# EAGLE design proto2 (EAGLE 9.5.0)

## Sheet 1 of 7: Front End
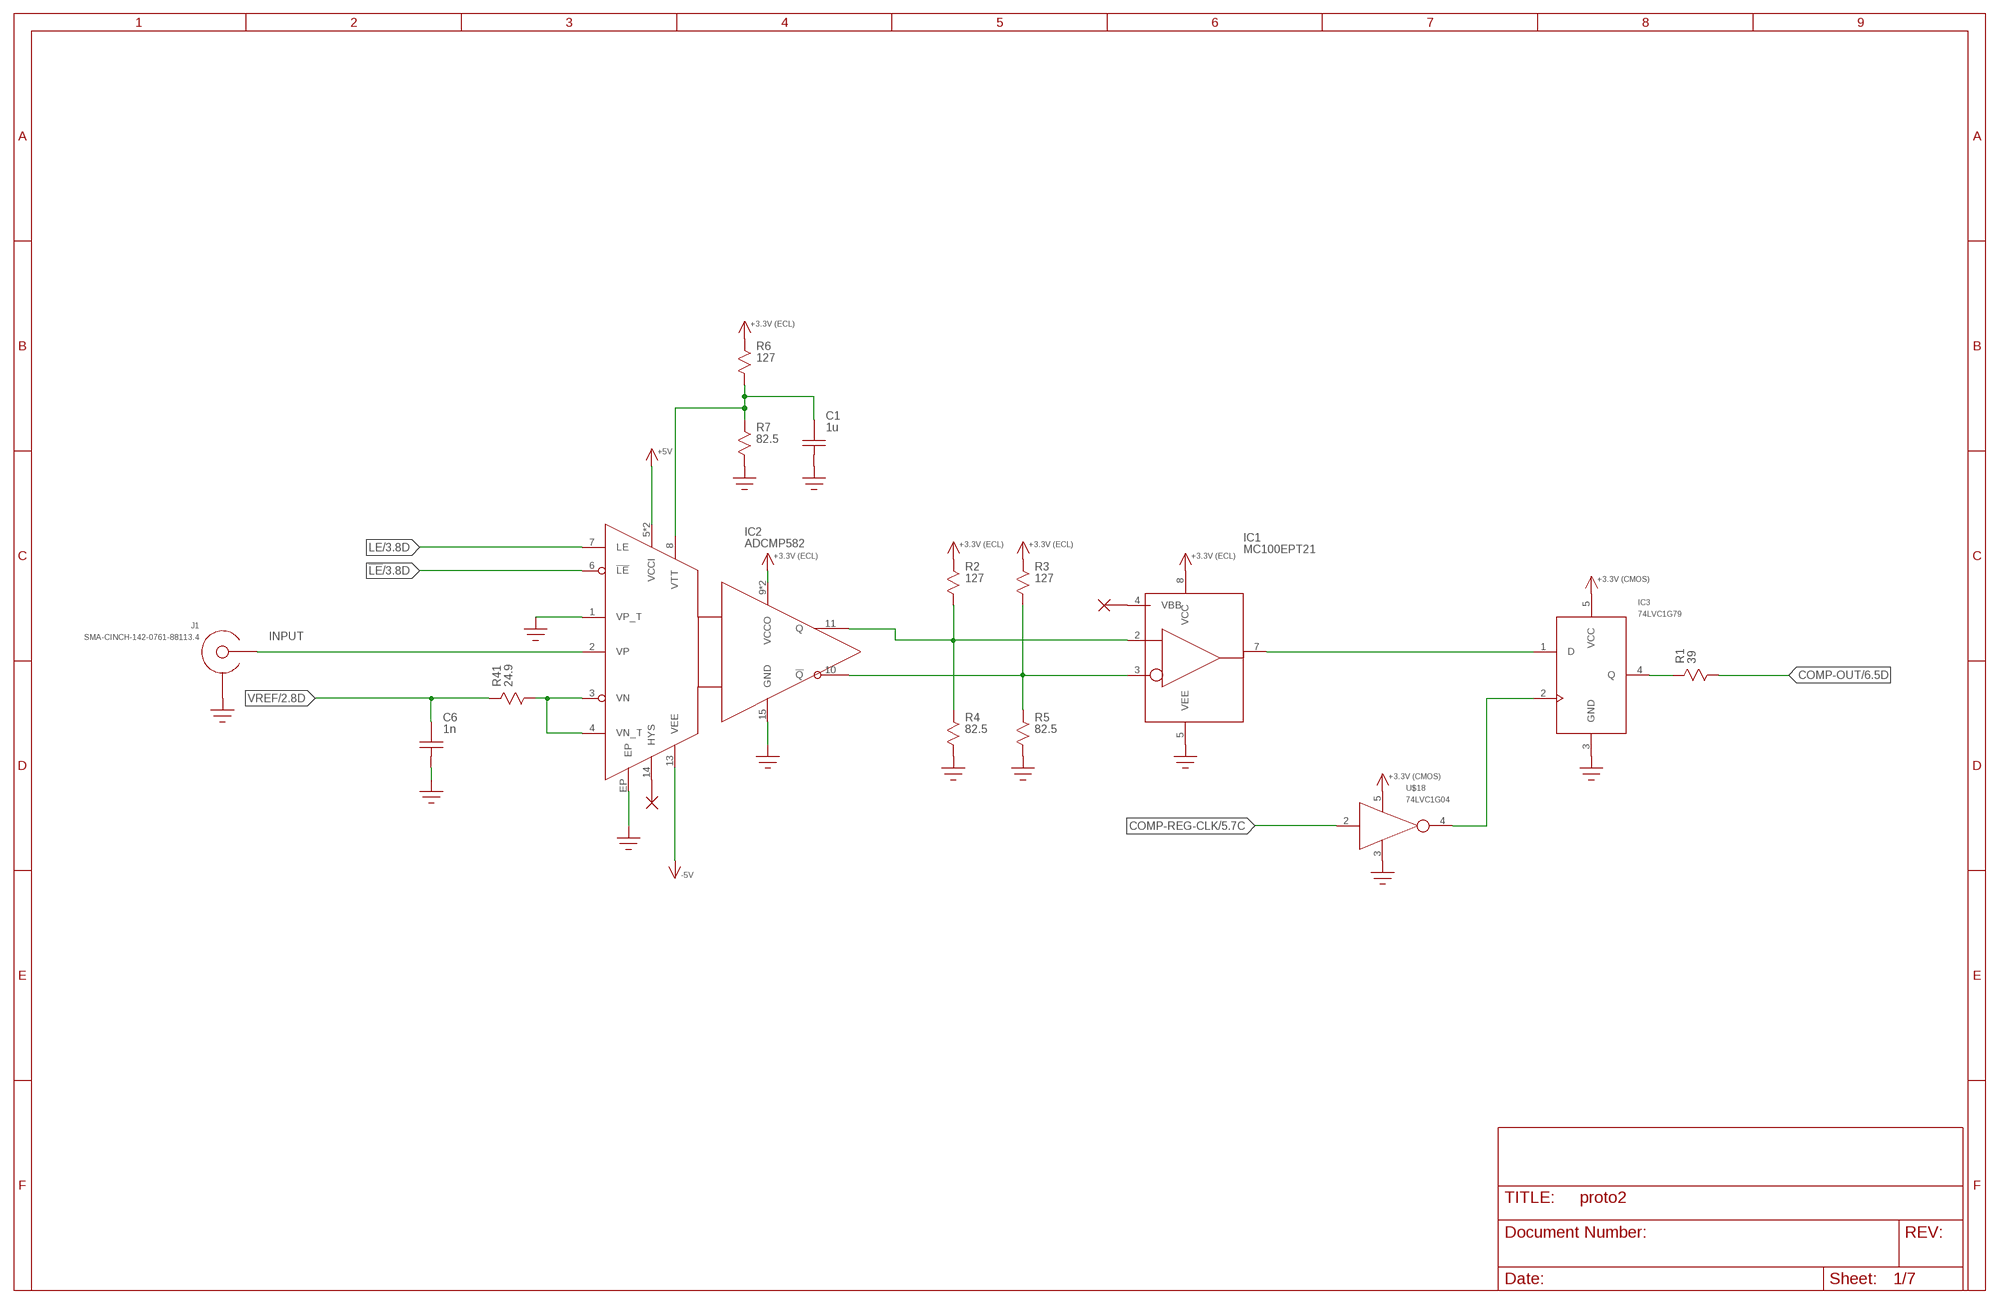
[diagram p0: schematic, sheet 1]

### Parts
C1  1u  C  [C0402]
C6  1n  C  [C0402]
IC1  MC100EPT21  [SOIC8]
IC2  ADCMP582  [TQFN16-EP]
IC3  74LVC1G79  [SOT23-5]
J1  SMA-CINCH-142-0761-88113.4  [SMA-CINCH-142-0761-881-13.4]
R1  39  R0603  [R0603]
R2  127  R0603  [R0603]
R3  127  R0603  [R0603]
R4  82.5  R0603  [R0603]
R5  82.5  R0603  [R0603]
R6  127  R0603  [R0603]
R7  82.5  R0603  [R0603]
R41  24.9  R0402  [0402]
U$4  NO_CONNECT  (no package)
U$9  NO_CONNECT  (no package)
U$18  74LVC1G04  [SOT23-5]

### Nets
!LE! [13.4-6]: IC2.6(!LE!) ; also sheet 3
+5V: IC2.5(VCCI) IC2.16(VCCI) ; also sheet 2,7
-5V: IC2.13(VEE) ; also sheet 2,7
COMP-OUT: R1.P$2 ; also sheet 6
COMP-REG-CLK: U$18.2(IN) ; also sheet 5
GND: C1.1 C6.1 IC1.5(VEE) IC2.1(VP_T) IC2.15(GND) IC2.EP IC3.3(GND) J1.GND@1(SHIELD) J1.GND@2(SHIELD) J1.GND@3(SHIELD) J1.HOLE@1(SHIELD) J1.HOLE@2(SHIELD) J1.HOLE@3(SHIELD) J1.HOLE@4(SHIELD) J1.VIA@1(SHIELD) J1.VIA@2(SHIELD) J1.VIA@3(SHIELD) J1.VIA@4(SHIELD) J1.VIA@5(SHIELD) J1.VIA@6(SHIELD) R4.P$2 R5.P$2 R7.P$2 U$18.3(GND) ; also sheet 2,3,4,5,6,7
INPUT [13.4-6]: IC2.2(VP) J1.CENTER
LE [13.4-6]: IC2.7(LE) ; also sheet 3
N$1: IC2.14(HYS) U$4.P$1
N$2: C1.2 IC2.8(VTT) R6.P$2 R7.P$1
N$3: IC1.4(VBB) U$9.P$1
N$4 [13.4-6]: IC1.3(!D!) IC2.10(!Q!) R3.P$2 R5.P$1
N$5 [13.4-6]: IC1.2(D) IC2.11(Q) R2.P$2 R4.P$1
N$7: IC1.7(Q) IC3.1(D)
N$8: IC3.4(Q) R1.P$1
N$9: IC3.2(CLK) U$18.4(OUT)
N$42: IC2.3(VN) IC2.4(VN_T) R41.2
VCC1: IC1.8(VCC) IC2.9(VCCO) IC2.12(VCCO) R2.P$1 R3.P$1 R6.P$1 ; supply symbol labelled +3.3V (ECL) ; also sheet 2,3,4,5,7
VCC2: IC3.5(VCC) U$18.5(VCC) ; supply symbol labelled +3.3V (CMOS) ; also sheet 5,6,7
VREF: C6.2 R41.1 ; also sheet 2

## Sheet 2 of 7: Reference Voltage Generator
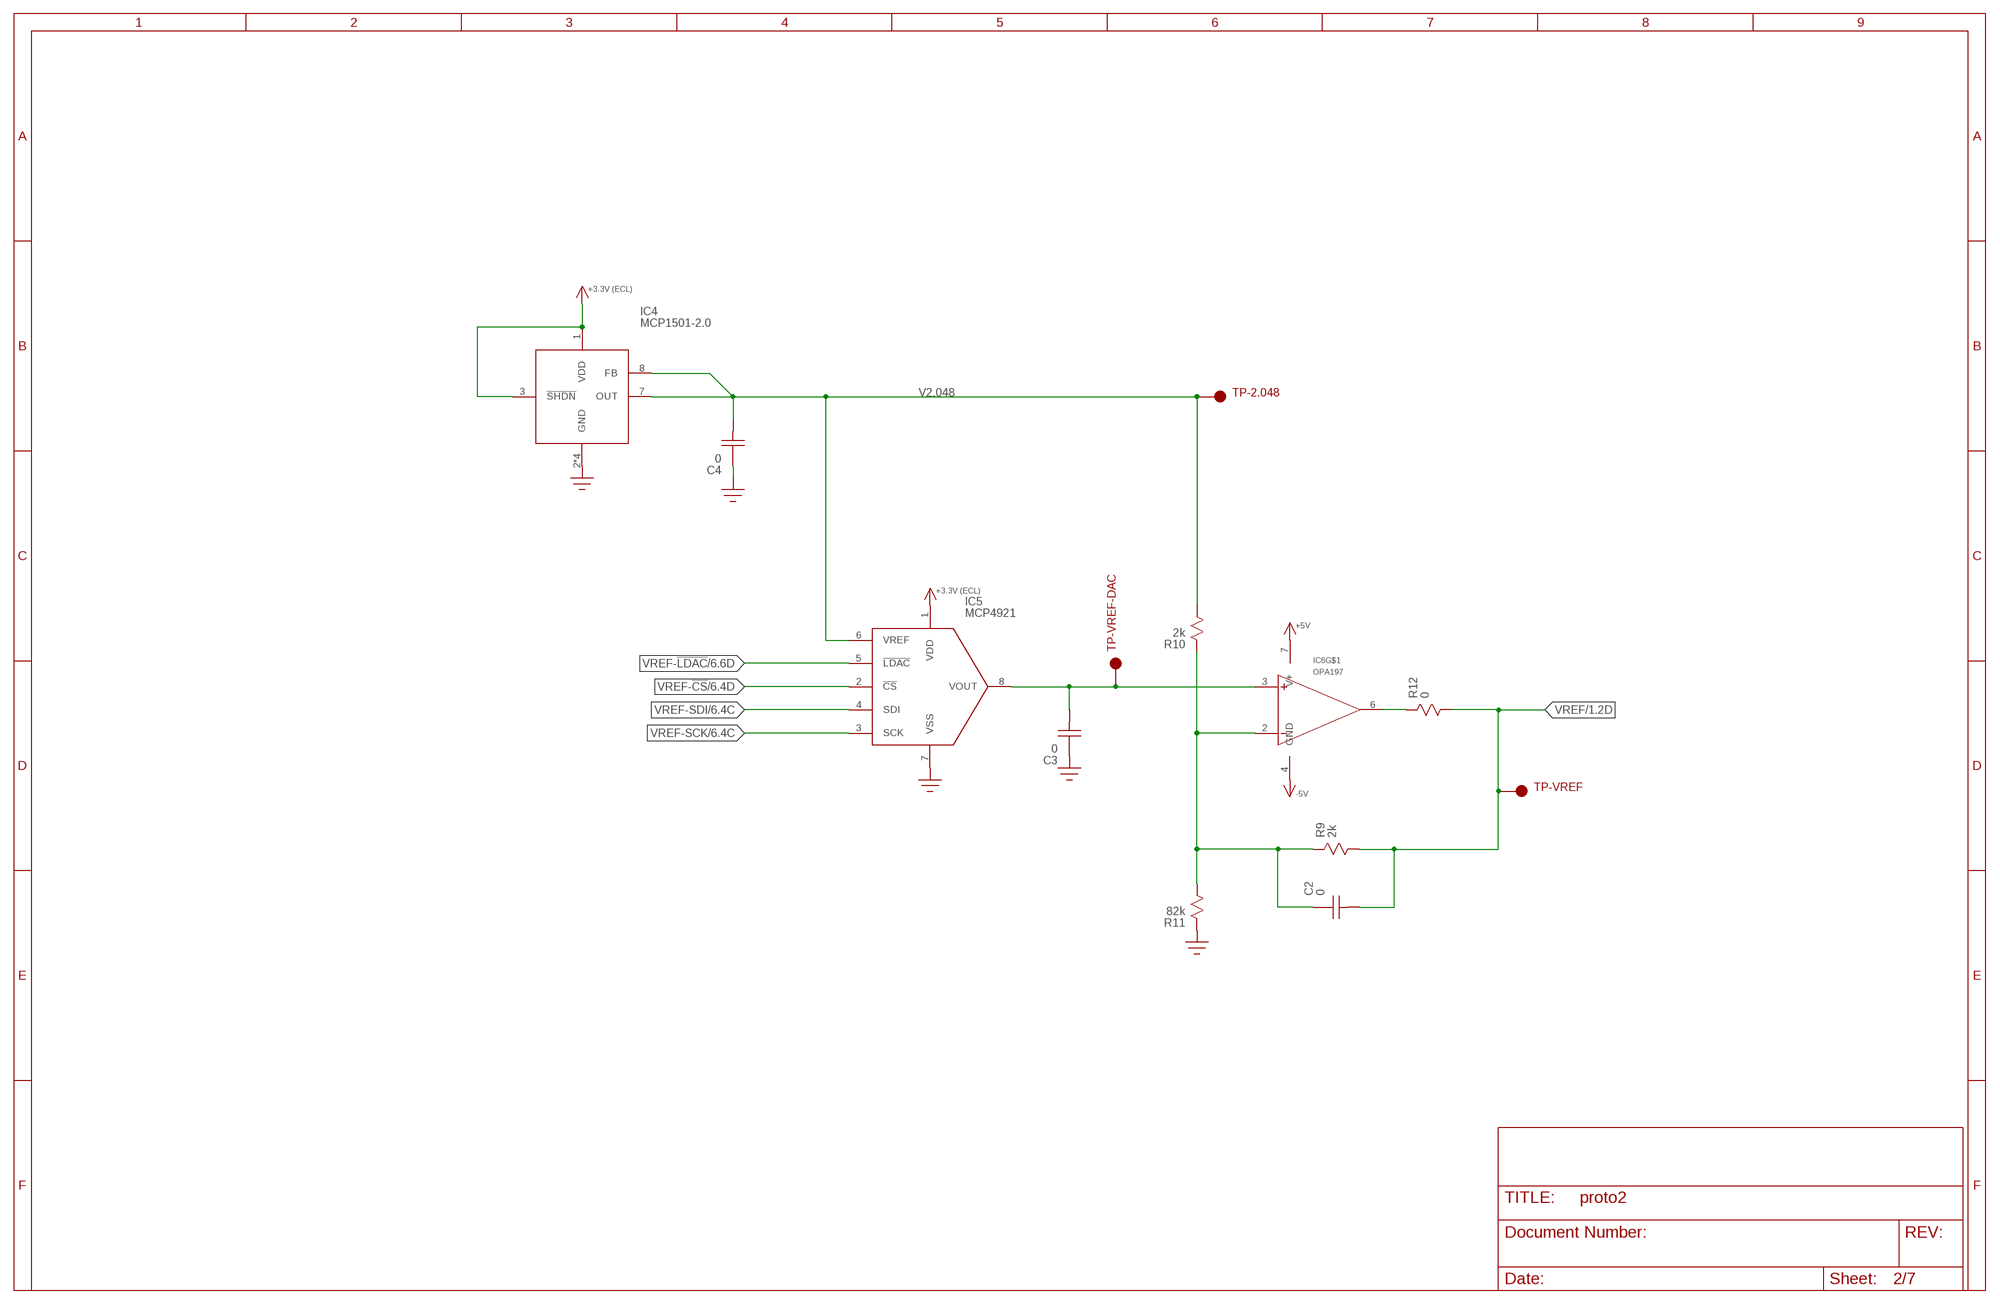
[diagram p1: schematic, sheet 2]

### Parts
C2  0  C0603  [C0603]
C3  0  C0603  [C0603]
C4  0  C0603  [C0603]
IC4  MCP1501-2.0  MCP1501SOIC8  [SOIC8]
IC5  MCP4921  MCP49X1  [SOIC8]
IC6  OPA197  OPA197SOIC8  [SOIC8]
R9  2k  R0603  [R0603]
R10  2k  R0603  [R0603]
R11  82k  R0603  [R0603]
R12  0  R0603  [R0603]
TP-2.048  ICSP_PAD  [ICSP_PAD]
TP-VREF  ICSP_PAD  [ICSP_PAD]
TP-VREF-DAC  ICSP_PAD  [ICSP_PAD]

### Nets
+5V: IC6.7(V+) ; also sheet 1,7
-5V: IC6.4(GND) ; also sheet 1,7
GND: C3.P$2 C4.P$2 IC4.2(GND) IC4.4(GND) IC4.5(GND) IC4.6(GND) IC5.7(VSS) R11.P$1 ; also sheet 1,3,4,5,6,7
N$6: C2.P$2 IC6.2(-) R9.P$1 R10.P$1 R11.P$2
N$11: IC6.6(OUT) R12.P$1
N$12: C3.P$1 IC5.8(VOUT) IC6.3(+) TP-VREF-DAC.P$1
V2.048: C4.P$1 IC4.7(OUT) IC4.8(FB) IC5.6(VREF) R10.P$2 TP-2.048.P$1
VCC1: IC4.1(VDD) IC4.3(!SHDN!) IC5.1(VDD) ; supply symbol labelled +3.3V (ECL) ; also sheet 1,3,4,5,7
VREF: C2.P$1 R9.P$2 R12.P$2 TP-VREF.P$1 ; also sheet 1
VREF-!CS!: IC5.2(!CS!) ; also sheet 6
VREF-!LDAC!: IC5.5(!LDAC!) ; also sheet 6
VREF-SCK: IC5.3(SCK) ; also sheet 6
VREF-SDI: IC5.4(SDI) ; also sheet 6

## Sheet 3 of 7: Delay Line
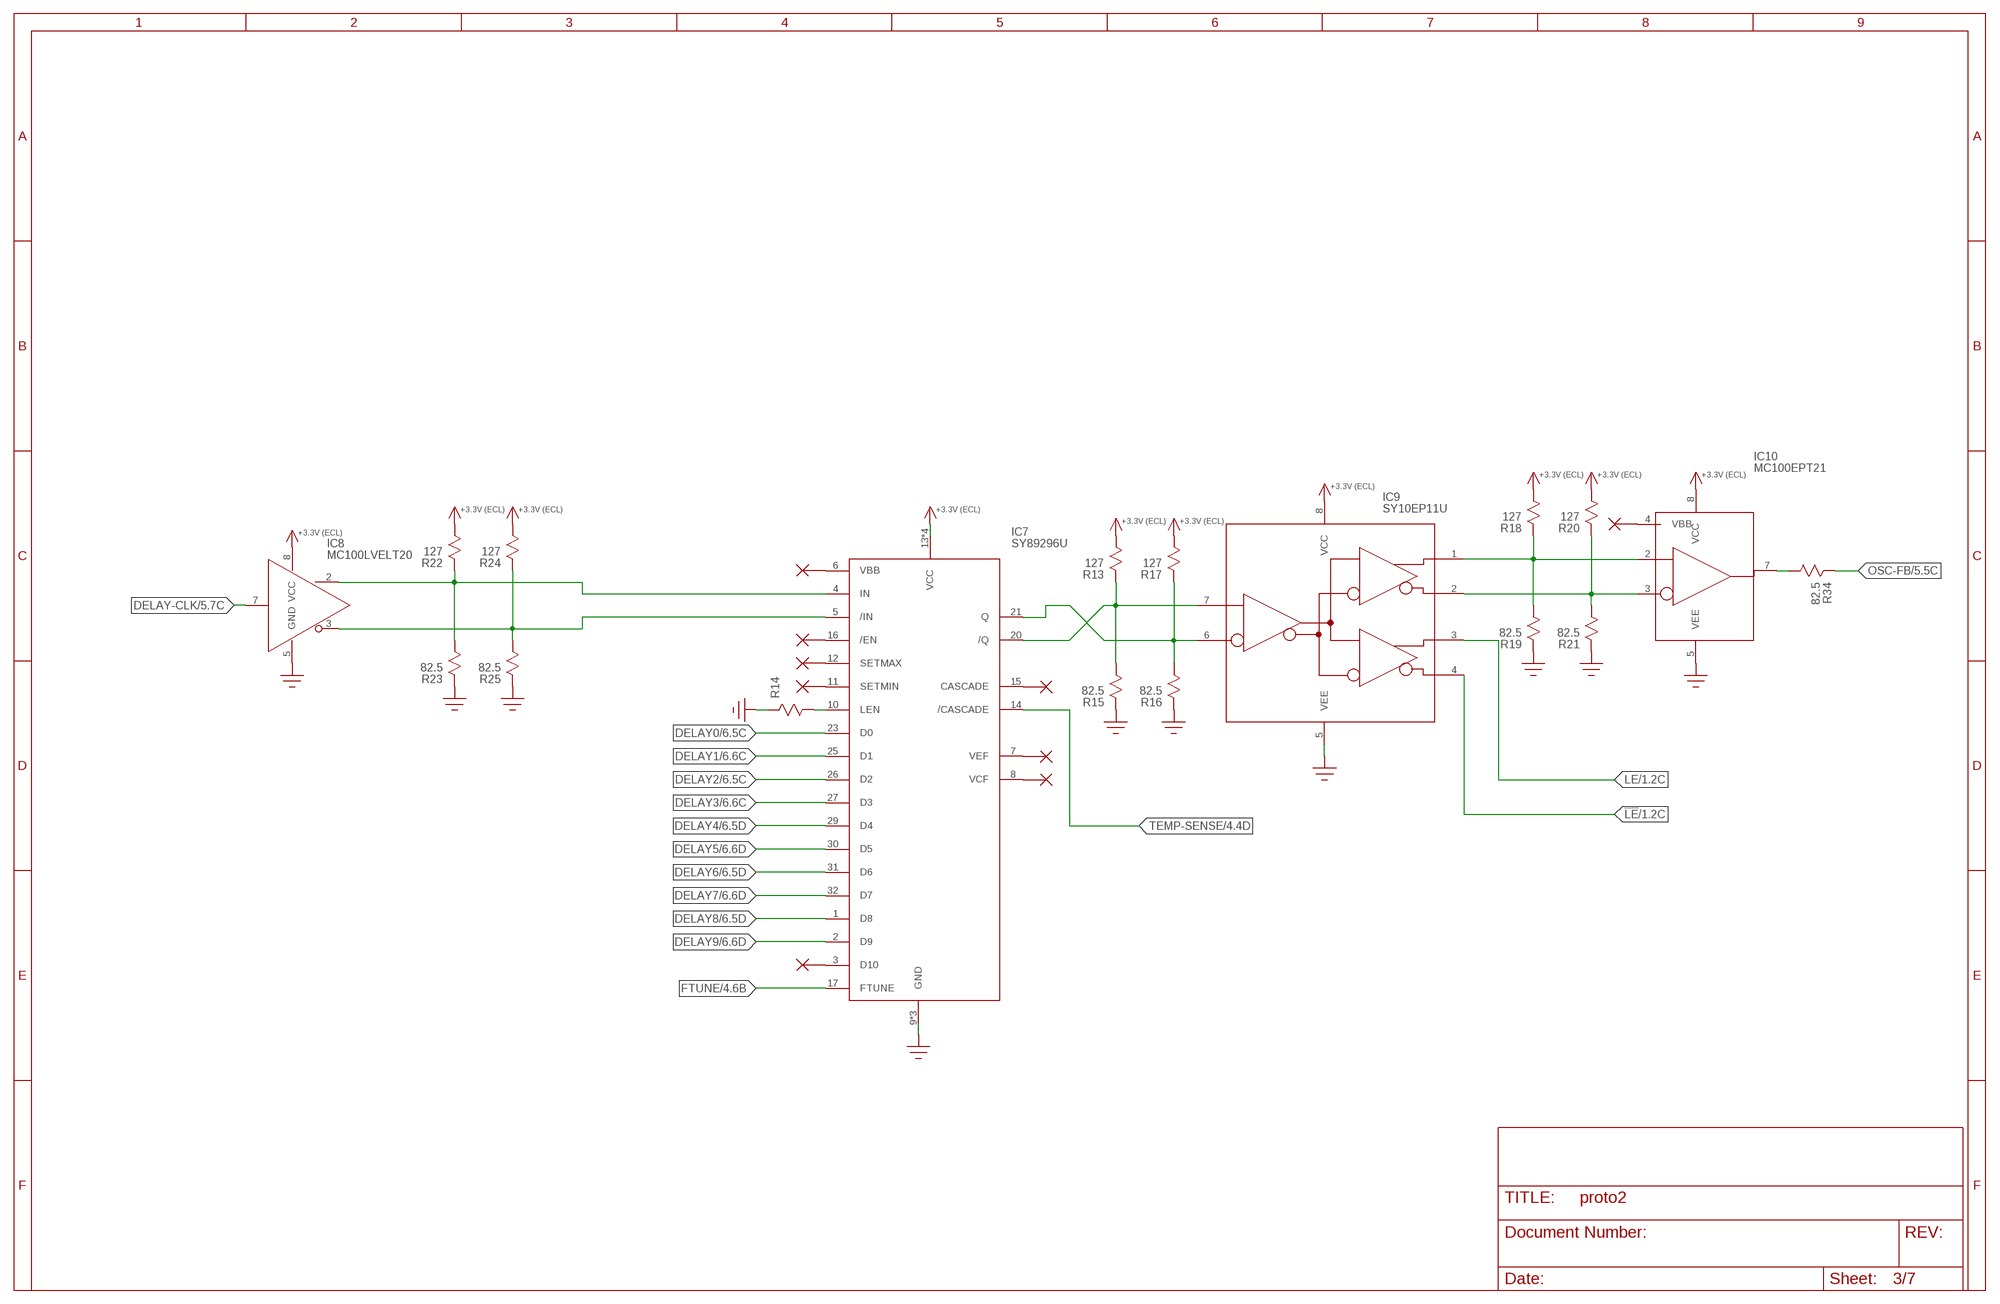
[diagram p2: schematic, sheet 3]

### Parts
IC7  SY89296U  [TQFP32_7X7]
IC8  MC100LVELT20  [SOIC8]
IC9  SY10EP11U  [SOIC8]
IC10  MC100EPT21  [SOIC8]
R13  127  R0603  [R0603]
R14  R0603  [R0603]
R15  82.5  R0603  [R0603]
R16  82.5  R0603  [R0603]
R17  127  R0603  [R0603]
R18  127  R0603  [R0603]
R19  82.5  R0603  [R0603]
R20  127  R0603  [R0603]
R21  82.5  R0603  [R0603]
R22  127  R0603  [R0603]
R23  82.5  R0603  [R0603]
R24  127  R0603  [R0603]
R25  82.5  R0603  [R0603]
R34  82.5  R0603  [R0603]
U$25  NO_CONNECT  (no package)
U$35  NO_CONNECT  (no package)
U$36  NO_CONNECT  (no package)
U$37  NO_CONNECT  (no package)
U$39  NO_CONNECT  (no package)
U$40  NO_CONNECT  (no package)
U$41  NO_CONNECT  (no package)
U$42  NO_CONNECT  (no package)
U$51  NO_CONNECT  (no package)

### Nets
!LE! [13.4-6]: IC9.4(!Q1!) ; also sheet 1
DELAY0: IC7.23(D0) ; also sheet 6
DELAY1: IC7.25(D1) ; also sheet 6
DELAY2: IC7.26(D2) ; also sheet 6
DELAY3: IC7.27(D3) ; also sheet 6
DELAY4: IC7.29(D4) ; also sheet 6
DELAY5: IC7.30(D5) ; also sheet 6
DELAY6: IC7.31(D6) ; also sheet 6
DELAY7: IC7.32(D7) ; also sheet 6
DELAY8: IC7.1(D8) ; also sheet 6
DELAY9: IC7.2(D9) ; also sheet 6
DELAY-!IN!: IC7.5(/IN) IC8.3(!Q!) R24.P$1 R25.P$2
DELAY-CLK: IC8.7(D) ; also sheet 5
DELAY-IN: IC7.4(IN) IC8.2(Q) R22.P$1 R23.P$2
FTUNE: IC7.17(FTUNE) ; also sheet 4
GND: IC7.9(GND) IC7.24(GND) IC7.28(GND) IC8.5(GND) IC9.5(VEE) IC10.5(VEE) R14.P$1 R15.P$1 R16.P$1 R19.P$1 R21.P$1 R23.P$1 R25.P$1 ; also sheet 1,2,4,5,6,7
LE [13.4-6]: IC9.3(Q1) ; also sheet 1
N$14: IC7.3(D10) U$25.P$1
N$15: IC7.7(VEF) U$35.P$1
N$16: IC7.8(VCF) U$36.P$1
N$17: IC7.6(VBB) U$37.P$1
N$18: IC7.10(LEN) R14.P$2
N$19: IC7.12(SETMAX) U$39.P$1
N$20: IC7.11(SETMIN) U$40.P$1
N$21: IC7.16(/EN) U$41.P$1
N$22: IC7.15(CASCADE) U$42.P$1
N$24: IC10.7(Q) R34.P$2
N$25 [13.4-6]: IC7.20(/Q) IC9.7(D) R13.P$1 R15.P$2
N$26 [13.4-6]: IC9.1(Q0) IC10.2(D) R18.P$1 R19.P$2
N$27 [13.4-6]: IC7.21(Q) IC9.6(!D!) R16.P$2 R17.P$1
N$28: IC10.4(VBB) U$51.P$1
N$40 [13.4-6]: IC9.2(!Q0!) IC10.3(!D!) R20.P$1 R21.P$2
OSC-FB: R34.P$1 ; also sheet 5
TEMP-SENSE: IC7.14(/CASCADE) ; also sheet 4
VCC1: IC7.13(VCC) IC7.18(VCC) IC7.19(VCC) IC7.22(VCC) IC8.8(VCC) IC9.8(VCC) IC10.8(VCC) R13.P$2 R17.P$2 R18.P$2 R20.P$2 R22.P$2 R24.P$2 ; supply symbol labelled +3.3V (ECL) ; also sheet 1,2,4,5,7

## Sheet 4 of 7: Delay Tune
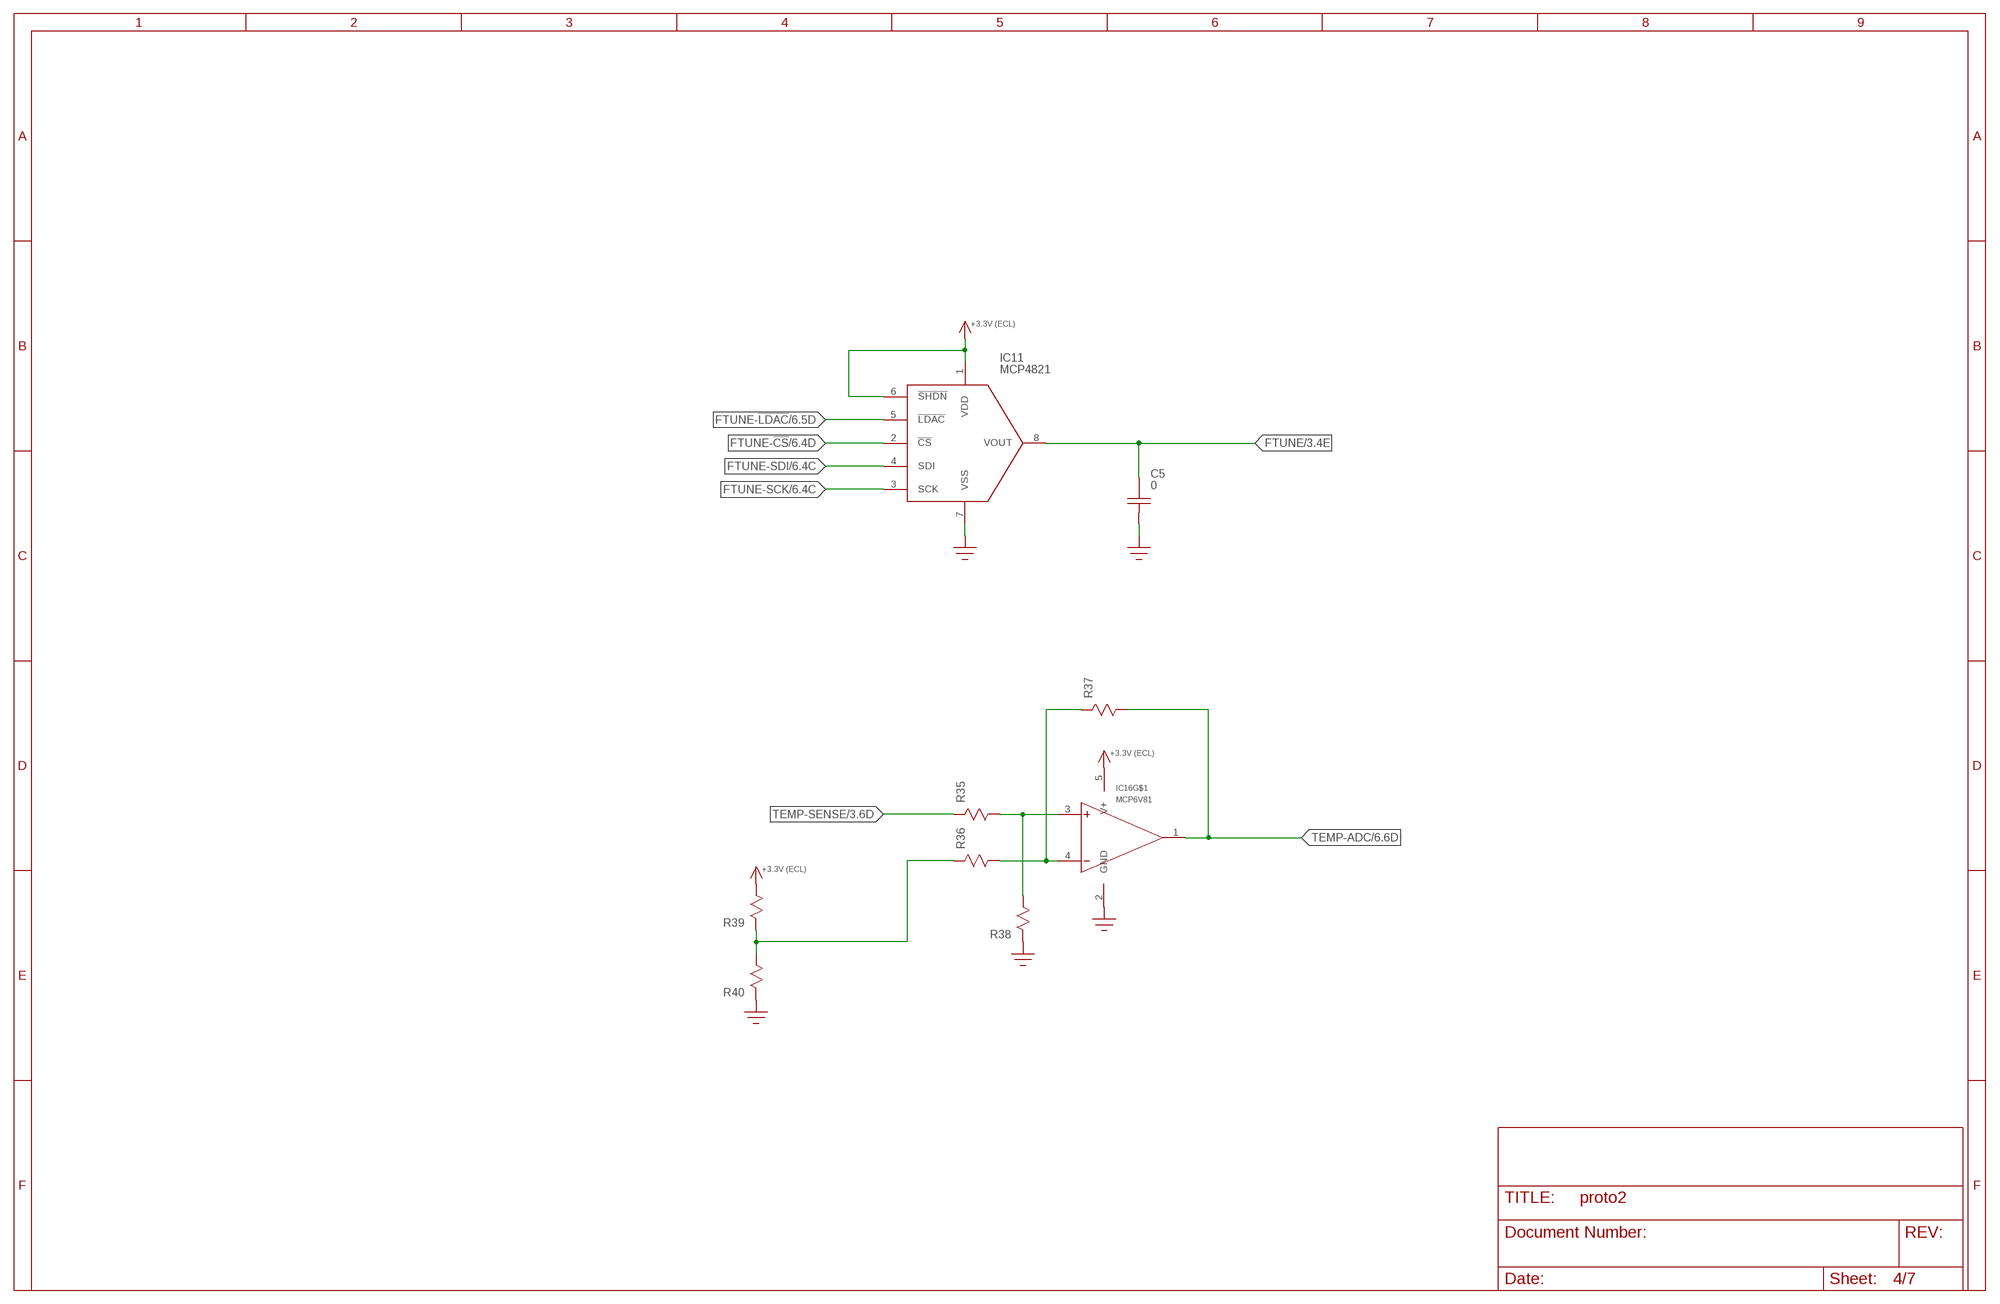
[diagram p3: schematic, sheet 4]

### Parts
C5  0  C0603  [C0603]
IC11  MCP4821  MCP48X1  [SOIC8]
IC16  MCP6V81  [SOT23-5]
R35  R0603  [R0603]
R36  R0603  [R0603]
R37  R0603  [R0603]
R38  R0603  [R0603]
R39  R0603  [R0603]
R40  R0603  [R0603]

### Nets
FTUNE: C5.P$2 IC11.8(VOUT) ; also sheet 3
FTUNE-!CS!: IC11.2(!CS!) ; also sheet 6
FTUNE-!LDAC!: IC11.5(!LDAC!) ; also sheet 6
FTUNE-SCK: IC11.3(SCK) ; also sheet 6
FTUNE-SDI: IC11.4(SDI) ; also sheet 6
GND: C5.P$1 IC11.7(VSS) IC16.2(GND) R38.P$1 R40.P$1 ; also sheet 1,2,3,5,6,7
N$35: IC16.3(+) R35.P$2 R38.P$2
N$41: IC16.4(-) R36.P$2 R37.P$1
N$44: R36.P$1 R39.P$1 R40.P$2
TEMP-ADC: IC16.1(OUT) R37.P$2 ; also sheet 6
TEMP-SENSE: R35.P$1 ; also sheet 3
VCC1: IC11.1(VDD) IC11.6(!SHDN!) IC16.5(V+) R39.P$2 ; supply symbol labelled +3.3V (ECL) ; also sheet 1,2,3,5,7

## Sheet 5 of 7: Clock Distribution
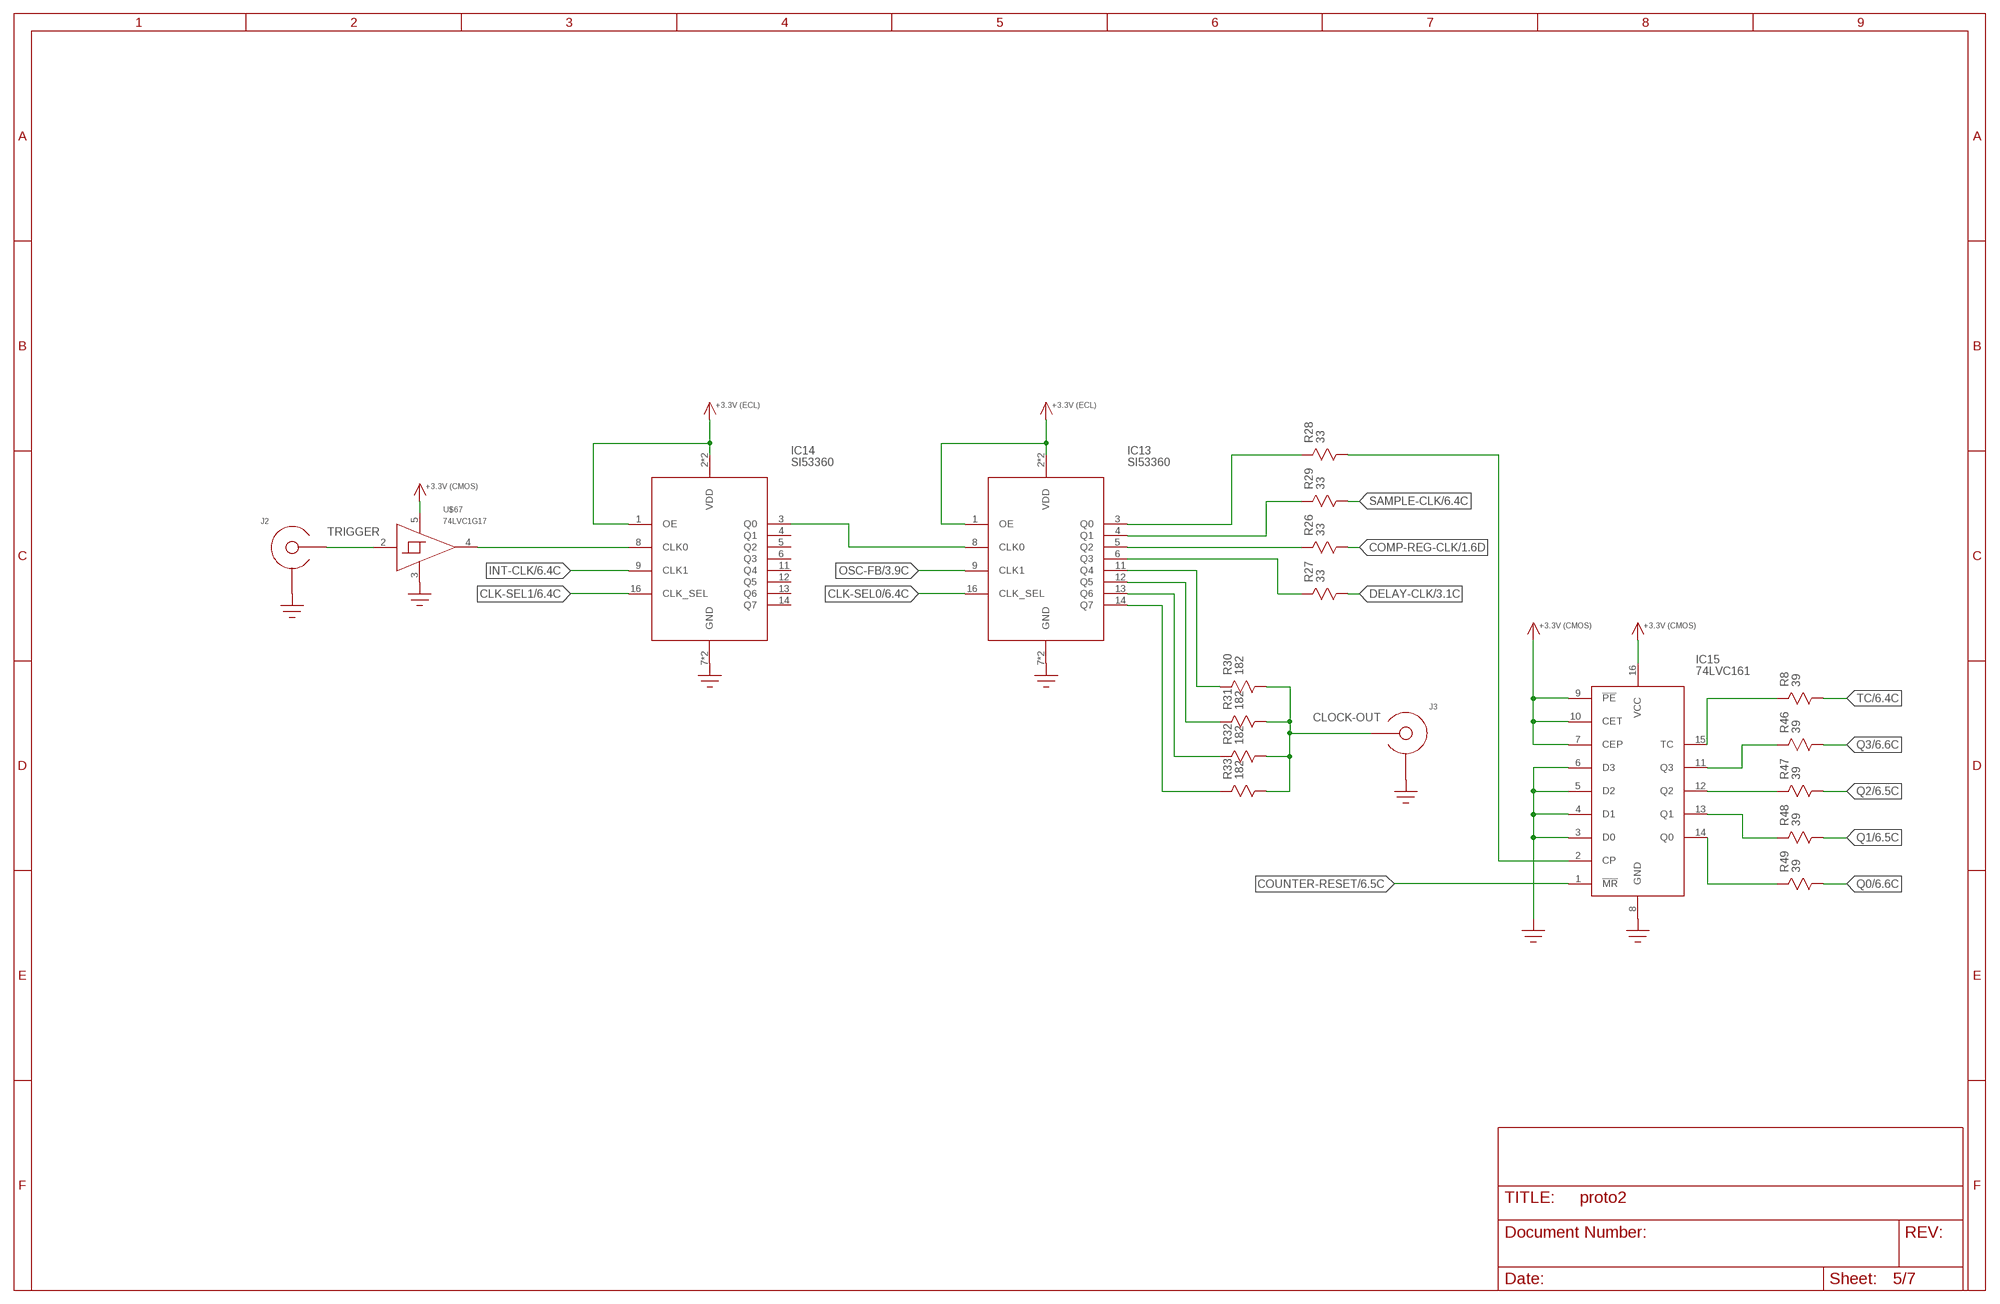
[diagram p4: schematic, sheet 5]

### Parts
IC13  SI53360  SI53360TSSOP16  [TSSOP16]
IC14  SI53360  SI53360TSSOP16  [TSSOP16]
IC15  74LVC161  74XX161  [SOIC-16]
J2  SMA-EDGE-LAUNCH4L-4020-TAPER-FIXED  [SMA_EDGE_LAUNCH_4L_4020_TAPER_FIXED]
J3  SMA-EDGE-LAUNCH4L-4020-TAPER-FIXED  [SMA_EDGE_LAUNCH_4L_4020_TAPER_FIXED]
R8  39  R0402  [0402]
R26  33  R0603  [R0603]
R27  33  R0603  [R0603]
R28  33  R0603  [R0603]
R29  33  R0603  [R0603]
R30  182  R0603  [R0603]
R31  182  R0603  [R0603]
R32  182  R0603  [R0603]
R33  182  R0603  [R0603]
R46  39  R0402  [0402]
R47  39  R0402  [0402]
R48  39  R0402  [0402]
R49  39  R0402  [0402]
U$67  74LVC1G17  [SOT23-5]

### Nets
CLK-SEL0: IC13.16(CLK_SEL) ; also sheet 6
CLK-SEL1: IC14.16(CLK_SEL) ; also sheet 6
CLOCK-OUT: J3.CENTER@1(CENTER) J3.P$3(CENTER) R30.P$2 R31.P$2 R32.P$2 R33.P$2
COMP-REG-CLK: R26.P$2 ; also sheet 1
COUNTER-RESET: IC15.1(!MR!) ; also sheet 6
DELAY-CLK: R27.P$2 ; also sheet 3
GND: IC13.7(GND) IC13.10(GND) IC14.7(GND) IC14.10(GND) IC15.3(D0) IC15.4(D1) IC15.5(D2) IC15.6(D3) IC15.8(GND) J2.BOTTOM_GND(SHIELD) J2.GND@1(SHIELD) J2.GND@2(SHIELD) J2.GND@3(SHIELD) J2.GND@4(SHIELD) J2.GND@5(SHIELD) J2.GND@6(SHIELD) J2.GND@7(SHIELD) J2.GND@8(SHIELD) J2.GND@14(SHIELD) J2.GND@15(SHIELD) J2.GND@16(SHIELD) J2.GND@17(SHIELD) J2.GND_PAD1(SHIELD) J2.GND_PAD2(SHIELD) J2.P$1(SHIELD) J2.P$2(SHIELD) J3.BOTTOM_GND(SHIELD) J3.GND@1(SHIELD) J3.GND@2(SHIELD) J3.GND@3(SHIELD) J3.GND@4(SHIELD) J3.GND@5(SHIELD) J3.GND@6(SHIELD) J3.GND@7(SHIELD) J3.GND@8(SHIELD) J3.GND@14(SHIELD) J3.GND@15(SHIELD) J3.GND@16(SHIELD) J3.GND@17(SHIELD) J3.GND_PAD1(SHIELD) J3.GND_PAD2(SHIELD) J3.P$1(SHIELD) J3.P$2(SHIELD) U$67.3(GND) ; also sheet 1,2,3,4,6,7
INT-CLK: IC14.9(CLK1) ; also sheet 6
N$13: IC15.12(Q2) R47.1
N$23: IC13.5(Q2) R26.P$1
N$29: IC13.6(Q3) R27.P$1
N$30: IC13.4(Q1) R29.P$1
N$31: IC14.8(CLK0) U$67.4(OUT)
N$32: IC13.8(CLK0) IC14.3(Q0)
N$33: IC13.3(Q0) R28.P$1
N$34: IC15.2(CP) R28.P$2
N$36: IC13.11(Q4) R30.P$1
N$37: IC13.12(Q5) R31.P$1
N$38: IC13.13(Q6) R32.P$1
N$39: IC13.14(Q7) R33.P$1
N$55: IC15.11(Q3) R46.1
N$56: IC15.15(TC) R8.1
N$57: IC15.13(Q1) R48.1
N$58: IC15.14(Q0) R49.1
OSC-FB: IC13.9(CLK1) ; also sheet 3
Q0: R49.2 ; also sheet 6
Q1: R48.2 ; also sheet 6
Q2: R47.2 ; also sheet 6
Q3: R46.2 ; also sheet 6
SAMPLE-CLK: R29.P$2 ; also sheet 6
TC: R8.2 ; also sheet 6
TRIGGER: J2.CENTER@1(CENTER) J2.P$3(CENTER) U$67.2(IN)
VCC1: IC13.1(OE) IC13.2(VDD) IC13.15(VDD) IC14.1(OE) IC14.2(VDD) IC14.15(VDD) ; supply symbol labelled +3.3V (ECL) ; also sheet 1,2,3,4,7
VCC2: IC15.7(CEP) IC15.9(!PE!) IC15.10(CET) IC15.16(VCC) U$67.5(VCC) ; supply symbol labelled +3.3V (CMOS) ; also sheet 1,6,7
Unconnected: IC14.4(Q1) IC14.5(Q2) IC14.6(Q3) IC14.11(Q4) IC14.12(Q5) IC14.13(Q6) IC14.14(Q7)

## Sheet 6 of 7: Microcontroller
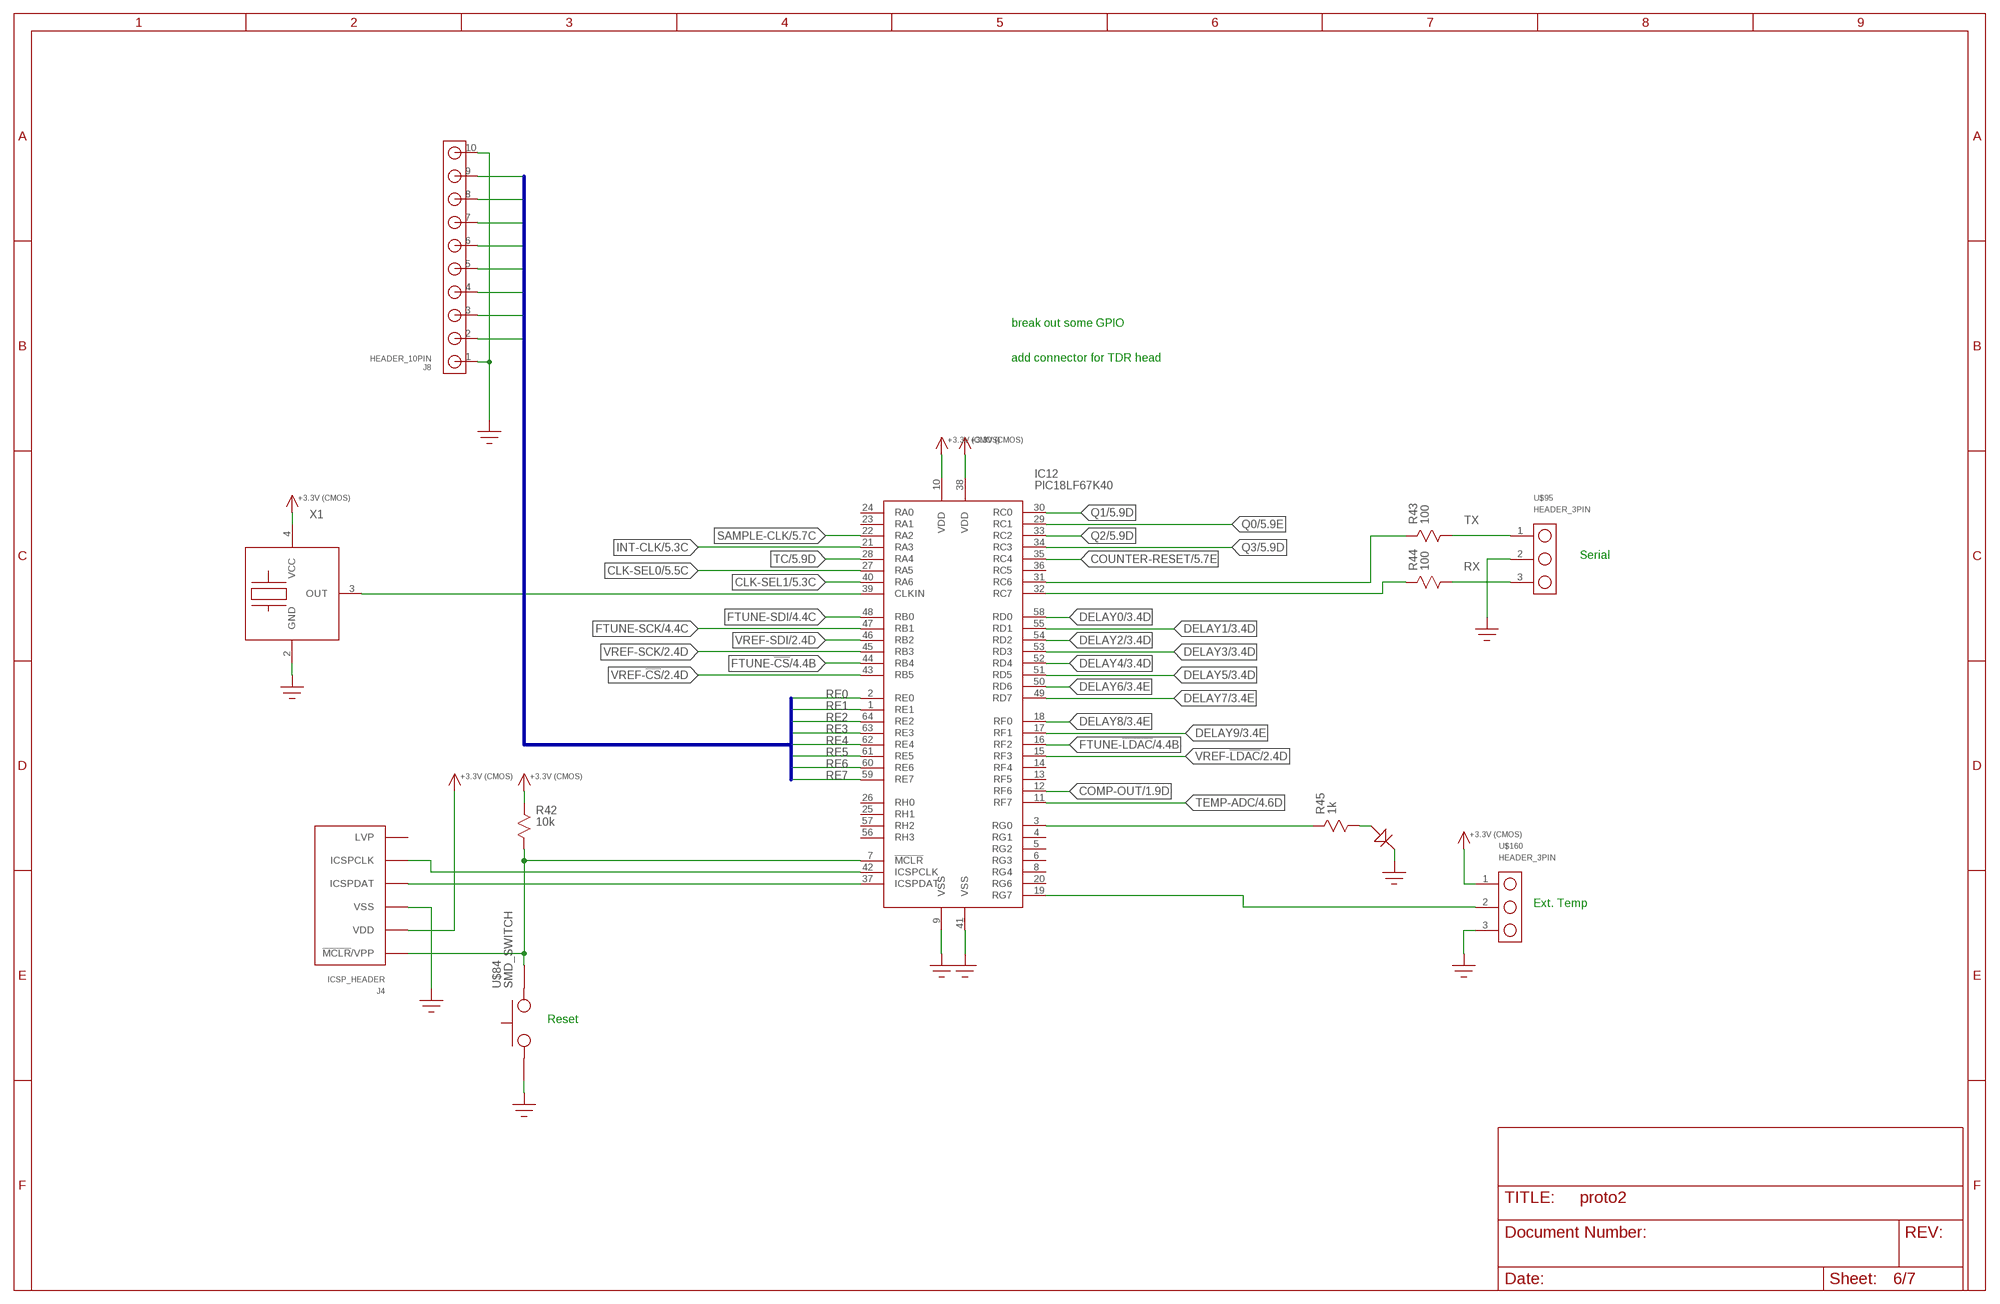
[diagram p5: schematic, sheet 6]

### Parts
IC12  PIC18LF67K40  [TQFP-100-10X10]
J4  ICSP_HEADER  [HEADER_6PIN]
J8  HEADER_10PIN  [HEADER_10PIN]
R42  10k  R0603  [R0603]
R43  100  R0603  [R0603]
R44  100  R0603  [R0603]
R45  1k  R0603  [R0603]
U$84  SMD_SWITCH  [SMD_SWITCH]
U$95  HEADER_3PIN  [HEADER_3PIN]
U$97  LED_0603  [LED_0603]
U$160  HEADER_3PIN  [HEADER_3PIN]
X1  XTAL_OSC  [XTAL_3.2X5]

### Nets
CLK-SEL0: IC12.27(RA5) ; also sheet 5
CLK-SEL1: IC12.40(RA6) ; also sheet 5
COMP-OUT: IC12.12(RF6) ; also sheet 1
COUNTER-RESET: IC12.35(RC4) ; also sheet 5
DELAY0: IC12.58(RD0) ; also sheet 3
DELAY1: IC12.55(RD1) ; also sheet 3
DELAY2: IC12.54(RD2) ; also sheet 3
DELAY3: IC12.53(RD3) ; also sheet 3
DELAY4: IC12.52(RD4) ; also sheet 3
DELAY5: IC12.51(RD5) ; also sheet 3
DELAY6: IC12.50(RD6) ; also sheet 3
DELAY7: IC12.49(RD7) ; also sheet 3
DELAY8: IC12.18(RF0) ; also sheet 3
DELAY9: IC12.17(RF1) ; also sheet 3
FTUNE-!CS!: IC12.44(RB4) ; also sheet 4
FTUNE-!LDAC!: IC12.16(RF2) ; also sheet 4
FTUNE-SCK: IC12.47(RB1) ; also sheet 4
FTUNE-SDI: IC12.48(RB0) ; also sheet 4
GND: IC12.9(VSS) IC12.41(VSS) J4.3(VSS) J8.1 J8.10 U$84.P$1 U$84.P$2 U$95.2 U$97.C U$160.3 X1.2(GND) ; also sheet 1,2,3,4,5,7
INT-CLK: IC12.21(RA3) ; also sheet 5
N$10: IC12.7(!MCLR!) J4.1(!MCLR!/VPP) R42.P$2 U$84.P$3 U$84.P$4
N$43: IC12.37(ICSPDAT) J4.4(ICSPDAT)
N$45: IC12.42(ICSPCLK) J4.5(ICSPCLK)
N$46: R45.P$2 U$97.A
N$47: IC12.39(CLKIN) X1.3(OUT)
N$48: IC12.32(RC7) R44.P$1
N$49: IC12.31(RC6) R43.P$1
N$50: IC12.3(RG0) R45.P$1
N$54: IC12.19(RG7) U$160.2
Q0: IC12.29(RC1) ; also sheet 5
Q1: IC12.30(RC0) ; also sheet 5
Q2: IC12.33(RC2) ; also sheet 5
Q3: IC12.34(RC3) ; also sheet 5
RE0: IC12.2(RE0) J8.9
RE1: IC12.1(RE1) J8.8
RE2: IC12.64(RE2) J8.7
RE3: IC12.63(RE3) J8.6
RE4: IC12.62(RE4) J8.5
RE5: IC12.61(RE5) J8.4
RE6: IC12.60(RE6) J8.3
RE7: IC12.59(RE7) J8.2
RX: R44.P$2 U$95.3
SAMPLE-CLK: IC12.22(RA2) ; also sheet 5
TC: IC12.28(RA4) ; also sheet 5
TEMP-ADC: IC12.11(RF7) ; also sheet 4
TX: R43.P$2 U$95.1
VCC2: IC12.10(VDD) IC12.38(VDD) J4.2(VDD) R42.P$1 U$160.1 X1.4(VCC) ; supply symbol labelled +3.3V (CMOS) ; also sheet 1,5,7
VREF-!CS!: IC12.43(RB5) ; also sheet 2
VREF-!LDAC!: IC12.15(RF3) ; also sheet 2
VREF-SCK: IC12.45(RB3) ; also sheet 2
VREF-SDI: IC12.46(RB2) ; also sheet 2
Unconnected: IC12.4(RG1) IC12.5(RG2) IC12.6(RG3) IC12.8(RG4) IC12.13(RF5) IC12.14(RF4) IC12.20(RG6) IC12.23(RA1) IC12.24(RA0) IC12.25(RH1) IC12.26(RH0) IC12.36(RC5) IC12.56(RH3) IC12.57(RH2) J4.6(LVP)

### Buses
RE0,RE1,RE2,RE3,RE4,RE5,RE6,RE7

### Notes on the sheet
- break out some GPIO
- add connector for TDR head
- Serial
- Ext. Temp
- Reset

## Sheet 7 of 7: Power
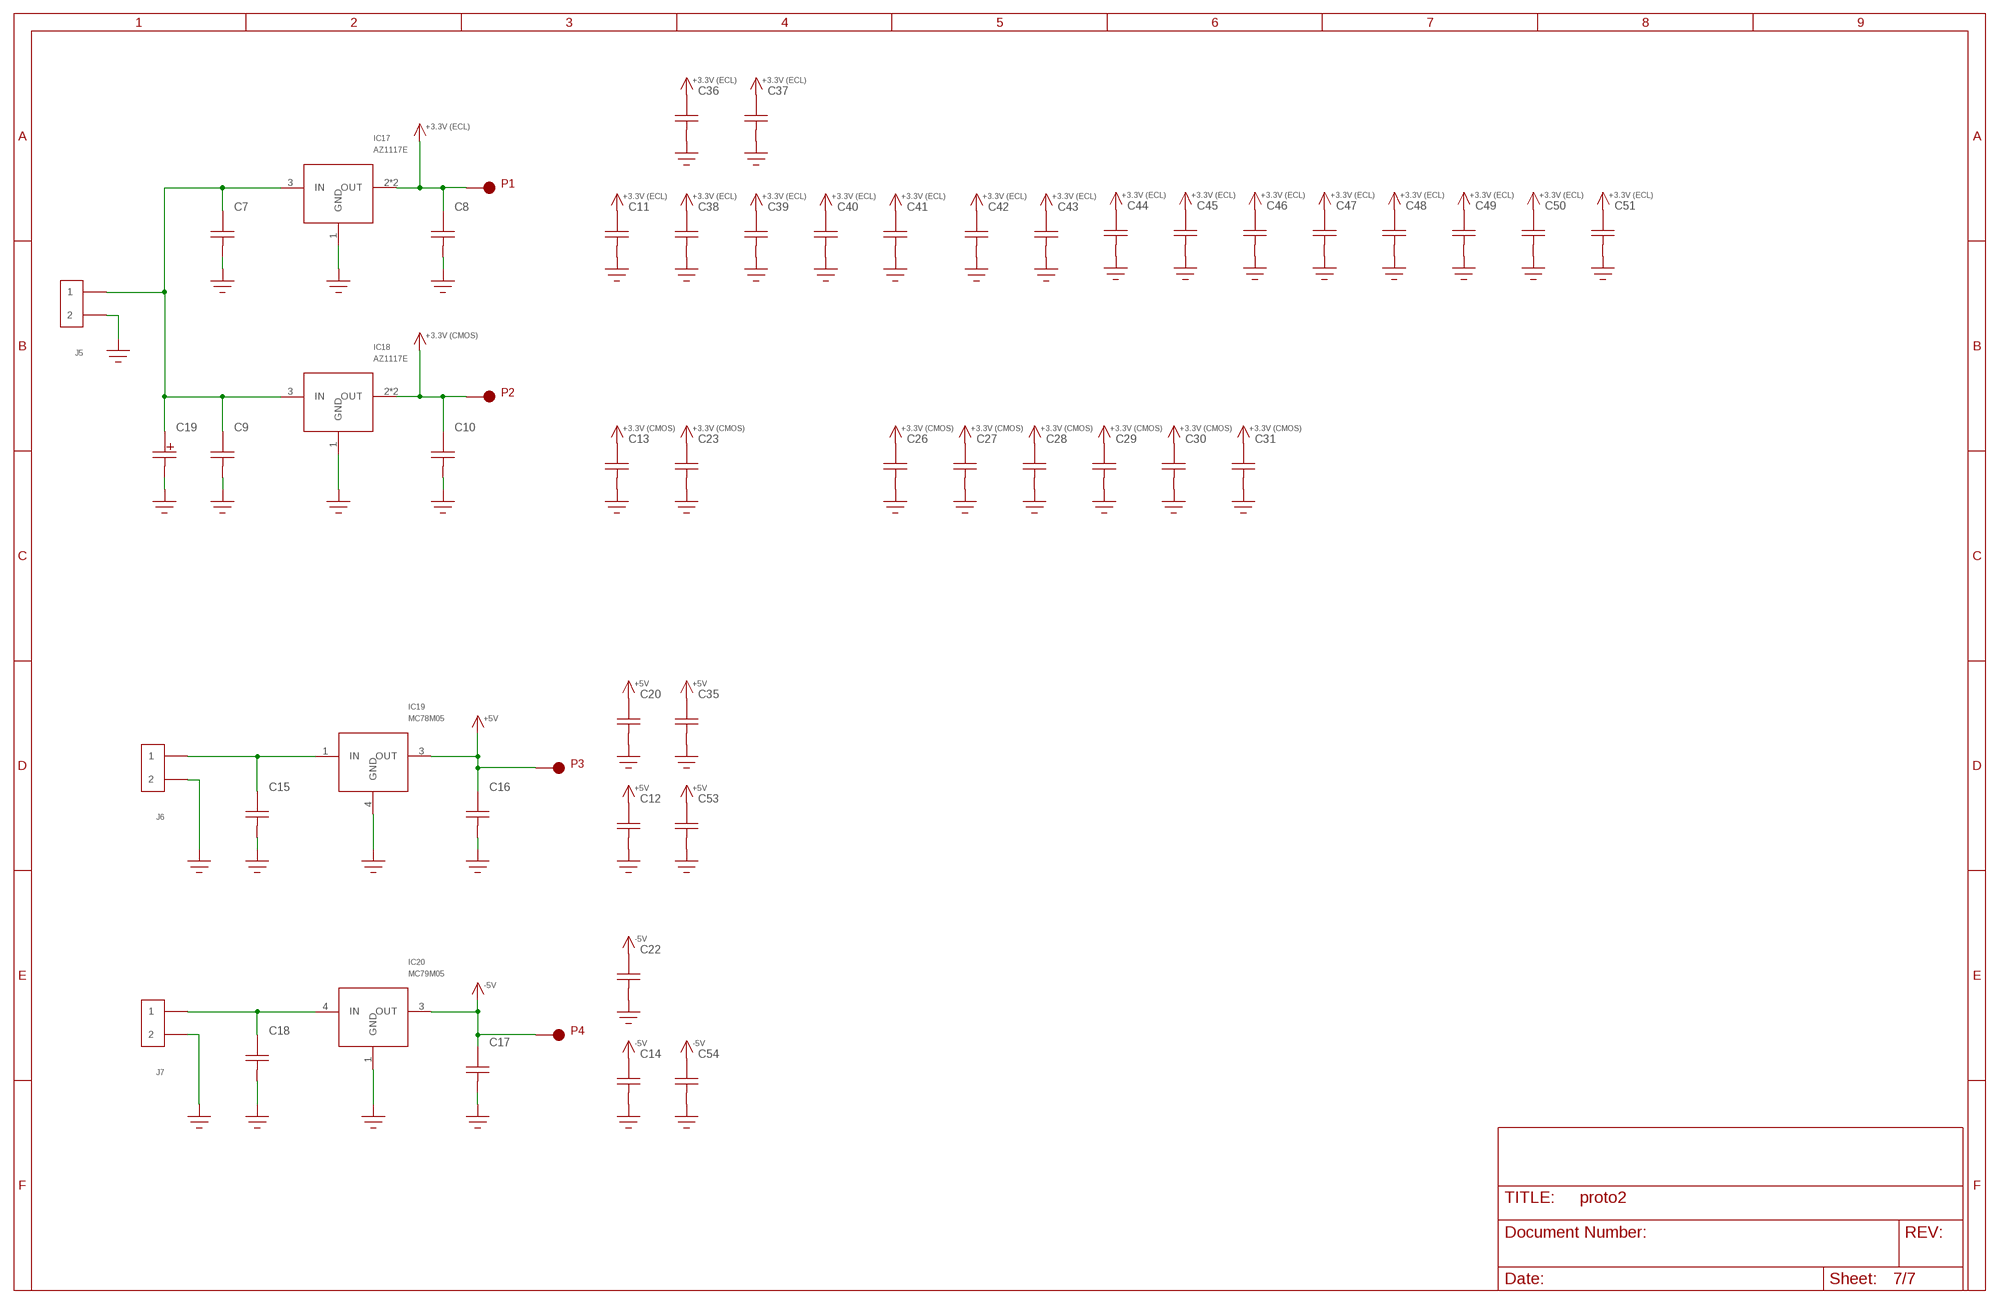
[diagram p6: schematic, sheet 7]

### Parts
C7  C1206  [1206]
C8  C1206  [1206]
C9  C1206  [1206]
C10  C1206  [1206]
C11  C0603  [C0603]
C12  C0603  [C0603]
C13  C0603  [C0603]
C14  C0603  [C0603]
C15  C1206  [1206]
C16  C1206  [1206]
C17  C1206  [1206]
C18  C1206  [1206]
C19  C-POLARIZED  [CAP-E61]
C20  C  [C0402]
C22  C  [C0402]
C23  C0603  [C0603]
C26  C0603  [C0603]
C27  C0603  [C0603]
C28  C0603  [C0603]
C29  C0603  [C0603]
C30  C0603  [C0603]
C31  C0603  [C0603]
C35  C  [C0402]
C36  C  [C0402]
C37  C  [C0402]
C38  C0603  [C0603]
C39  C0603  [C0603]
C40  C0603  [C0603]
C41  C0603  [C0603]
C42  C0603  [C0603]
C43  C0603  [C0603]
C44  C0603  [C0603]
C45  C0603  [C0603]
C46  C0603  [C0603]
C47  C0603  [C0603]
C48  C0603  [C0603]
C49  C0603  [C0603]
C50  C0603  [C0603]
C51  C0603  [C0603]
C53  C0603  [C0603]
C54  C0603  [C0603]
IC17  AZ1117E  [SOT-223]
IC18  AZ1117E  [SOT-223]
IC19  MC78M05  MC78M00  [DPAK]
IC20  MC79M05  MC79M00  [DPAK]
J5  HEADER_2PINSCREW-TERM  [FCI_20020316_SCREW_TERM_2P]
J6  HEADER_2PINSCREW-TERM  [FCI_20020316_SCREW_TERM_2P]
J7  HEADER_2PINSCREW-TERM  [FCI_20020316_SCREW_TERM_2P]
P1  ICSP_PAD  [ICSP_PAD]
P2  ICSP_PAD  [ICSP_PAD]
P3  ICSP_PAD  [ICSP_PAD]
P4  ICSP_PAD  [ICSP_PAD]

### Nets
+5V: C12.P$2 C16.P$2 C20.2 C35.2 C53.P$2 IC19.3(OUT) P3.P$1 ; also sheet 1,2
-5V: C14.P$2 C17.P$2 C22.2 C54.P$2 IC20.3(OUT) P4.P$1 ; also sheet 1,2
GND: C7.P$1 C8.P$1 C9.P$1 C10.P$1 C11.P$1 C12.P$1 C13.P$1 C14.P$1 C15.P$1 C16.P$1 C17.P$1 C18.P$1 C19.- C20.1 C22.1 C23.P$1 C26.P$1 C27.P$1 C28.P$1 C29.P$1 C30.P$1 C31.P$1 C35.1 C36.1 C37.1 C38.P$1 C39.P$1 C40.P$1 C41.P$1 C42.P$1 C43.P$1 C44.P$1 C45.P$1 C46.P$1 C47.P$1 C48.P$1 C49.P$1 C50.P$1 C51.P$1 C53.P$1 C54.P$1 IC17.1(GND) IC18.1(GND) IC19.4(GND) IC20.1(GND) J5.P$2 J6.P$2 J7.P$2 ; also sheet 1,2,3,4,5,6
N$51: C7.P$2 C9.P$2 C19.+ IC17.3(IN) IC18.3(IN) J5.P$1
N$52: C15.P$2 IC19.1(IN) J6.P$1
N$53: C18.P$2 IC20.4(IN) J7.P$1
VCC1: C8.P$2 C11.P$2 C36.2 C37.2 C38.P$2 C39.P$2 C40.P$2 C41.P$2 C42.P$2 C43.P$2 C44.P$2 C45.P$2 C46.P$2 C47.P$2 C48.P$2 C49.P$2 C50.P$2 C51.P$2 IC17.2(OUT) IC17.4(OUT) P1.P$1 ; supply symbol labelled +3.3V (ECL) ; also sheet 1,2,3,4,5
VCC2: C10.P$2 C13.P$2 C23.P$2 C26.P$2 C27.P$2 C28.P$2 C29.P$2 C30.P$2 C31.P$2 IC18.2(OUT) IC18.4(OUT) P2.P$1 ; supply symbol labelled +3.3V (CMOS) ; also sheet 1,5,6

## Library data of the parts
C1-C18 C20 C22 C23 C26-C31 C35-C51 C53 C54 = yapo:C
C19 = yapo:C-POLARIZED
IC1 IC10 = yapo:MC100EPT21
IC2 = yapo:ADCMP582
IC3 = yapo:74LVC1G79
IC4 = yapo:MCP1501
IC5 = yapo:MCP49X1
IC6 = yapo:OPA197
IC7 = yapo:SY89296U
IC8 = yapo:MC100LVELT20
IC9 = yapo:SY10EP11U
IC11 = yapo:MCP48X1
IC12 = yapo:PIC18LF67K40
IC13 IC14 = yapo:SI53360
IC15 = yapo:74XX161
IC16 = yapo:MCP6V81
IC17 IC18 = yapo:AZ1117E
IC19 = yapo:MC78M00
IC20 = yapo:MC79M00
J1 = yapo:SMA-CINCH-142-0761-881
J2 J3 = yapo:SMA-EDGE-LAUNCH
J4 = yapo:ICSP_HEADER
J5-J7 = yapo:HEADER_2PIN
J8 = yapo:HEADER_10PIN
P1-P4 TP-2.048 TP-VREF TP-VREF-DAC = yapo:ICSP_PAD
R1-R49 = yapo:R
U$4 U$9 U$25 U$35-U$37 U$39-U$42 U$51 = yapo:NO_CONNECT
U$18 = yapo:74LVC1G04
U$67 = yapo:74LVC1G17
U$84 = yapo:SMD_SWITCH; SPICEPREFIX: B
U$95 U$160 = yapo:HEADER_3PIN
U$97 = yapo:LED_0603
X1 = yapo:XTAL_OSC

## Net classes
1 13.4-6: width 0.34 mm, clearance 0.152 mm

## Board
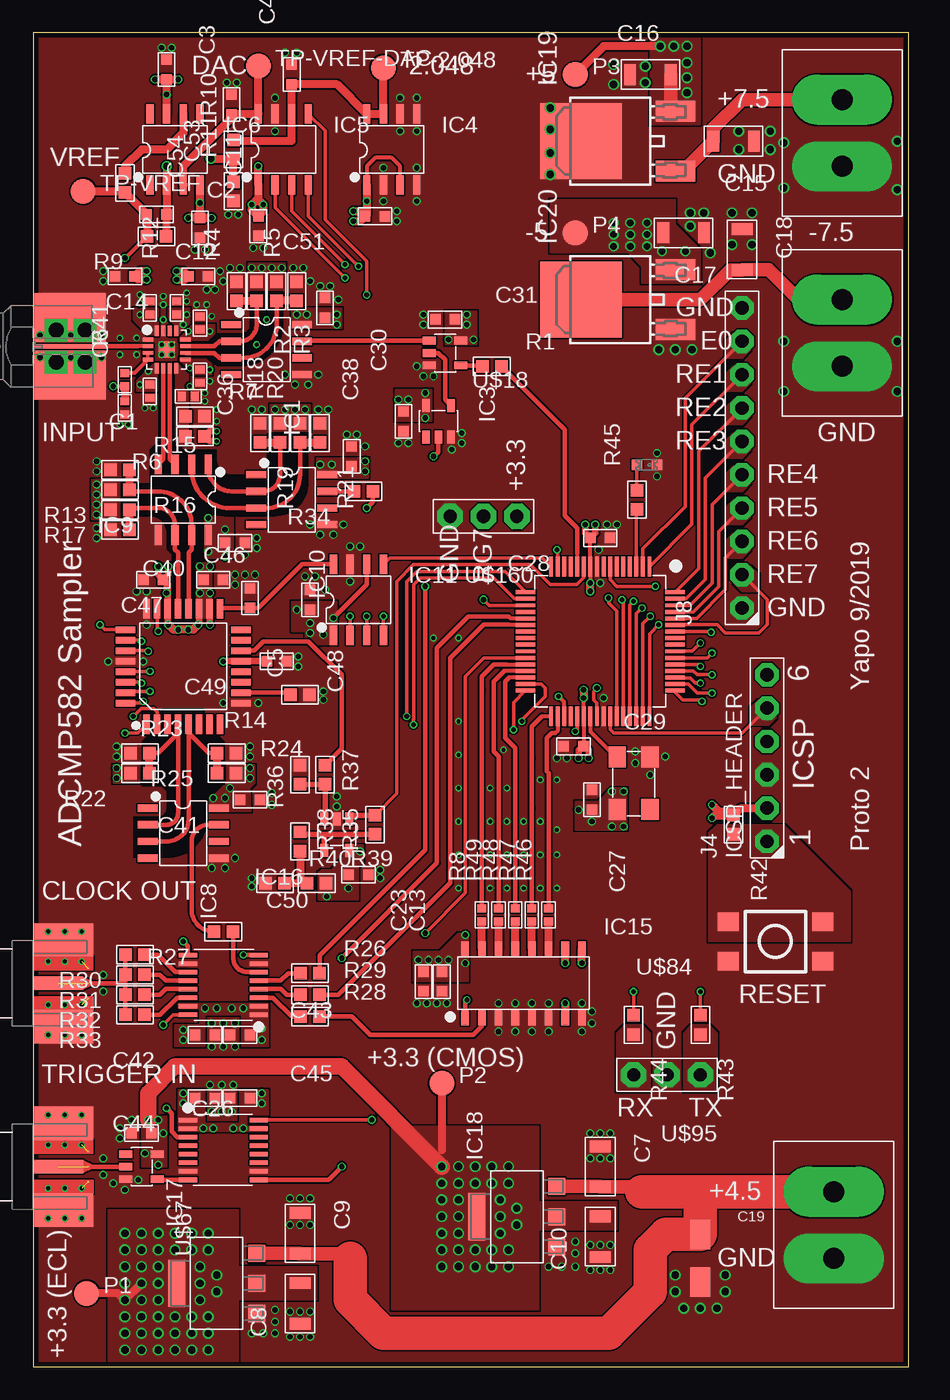
[diagram p7: board, top side]
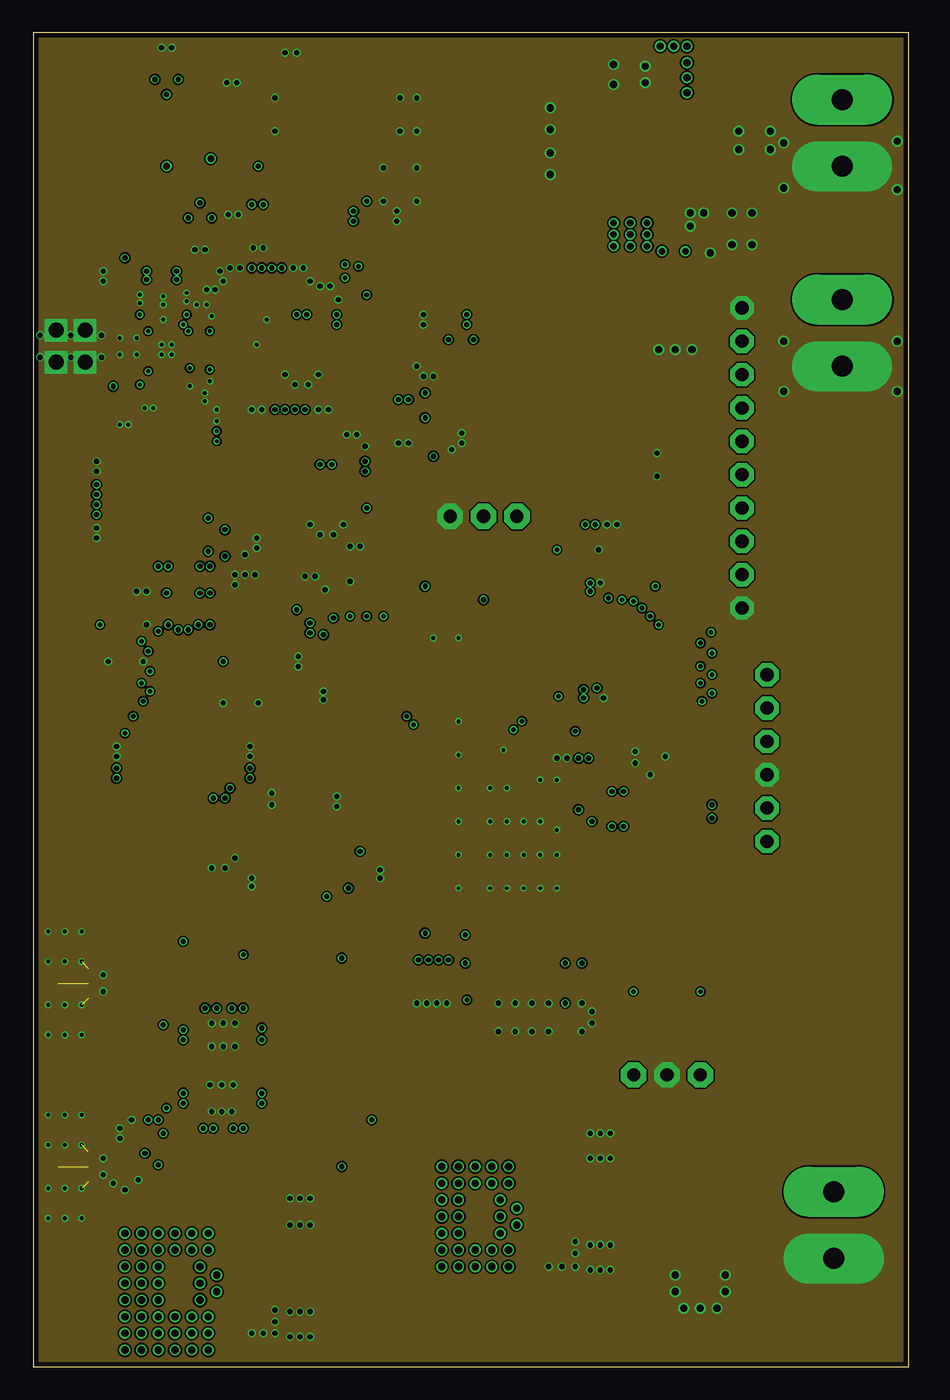
[diagram p8: board, inner layer Route2]
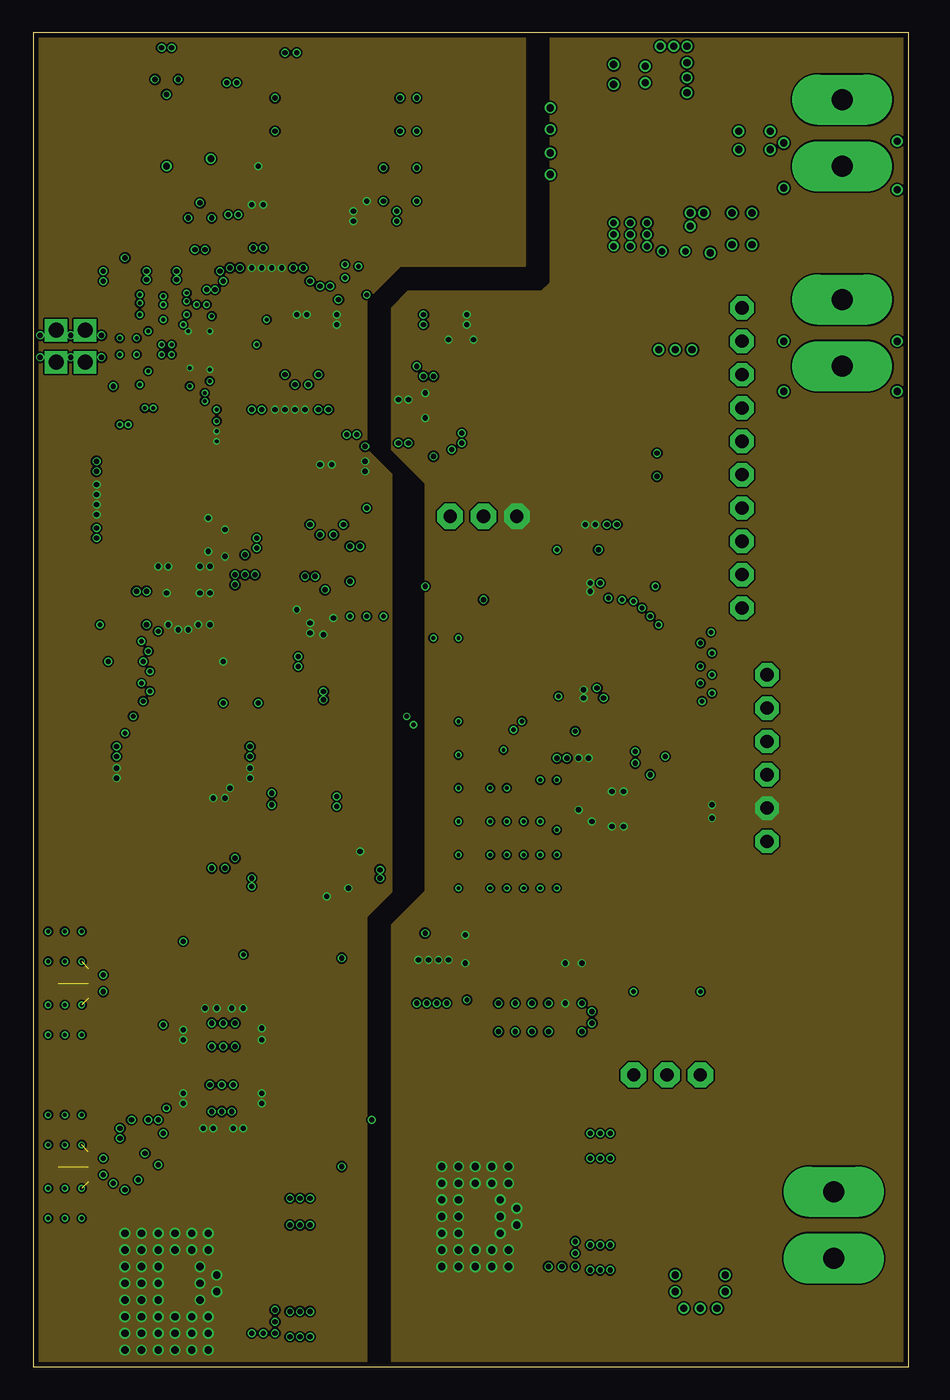
[diagram p9: board, inner layer Route15]
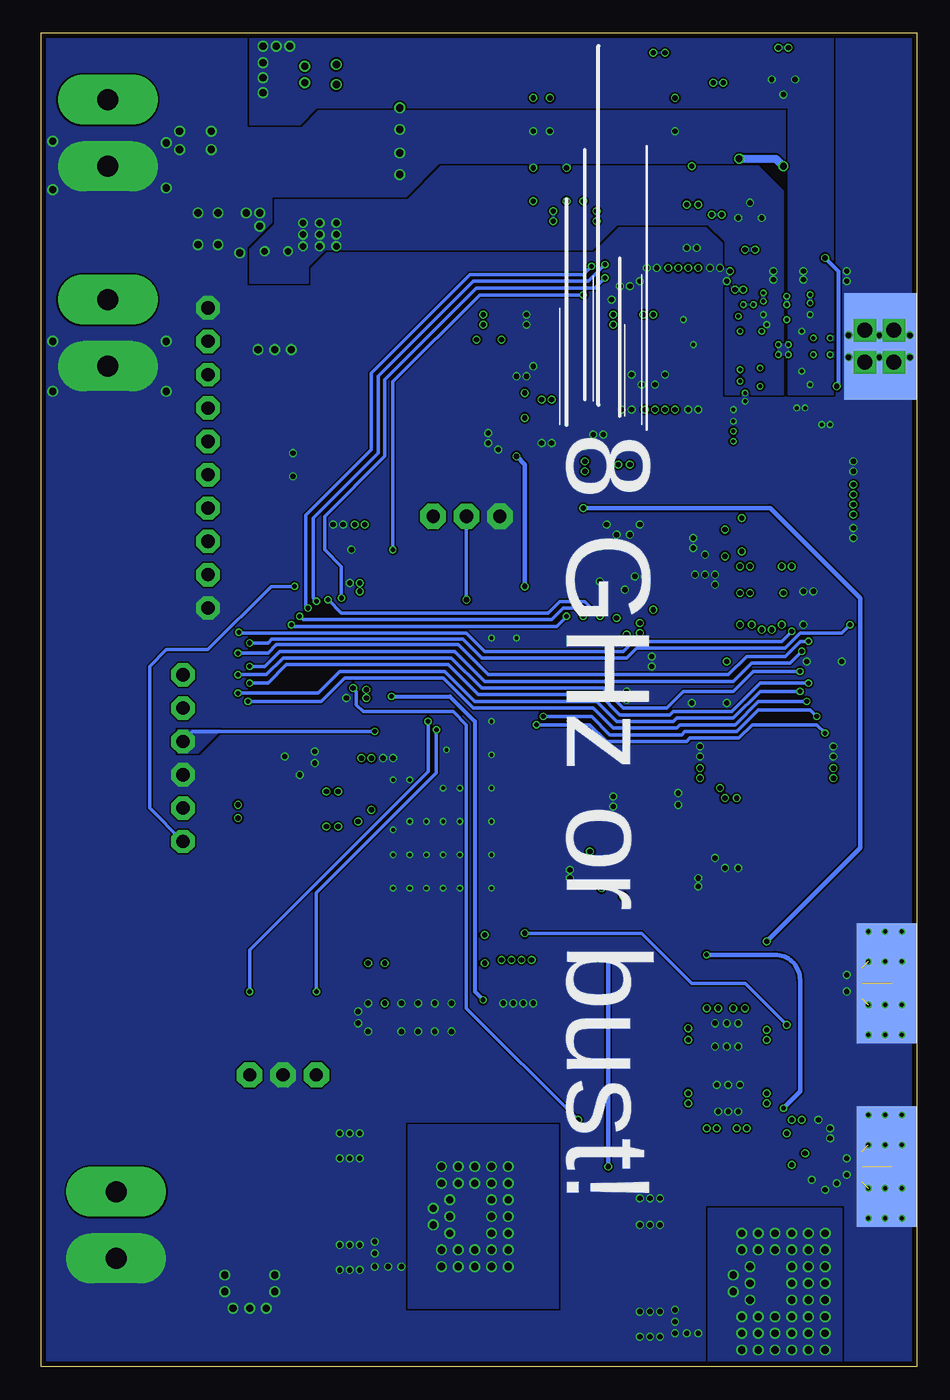
[diagram p10: board, bottom side, seen from below]

Size 66.67 x 101.6 mm. Coordinates in mm from the lower left corner, seen from the top.
Outline: 0,0 66.67,0 66.67,101.6 0,101.6 0,0
Copper layers (1*2*15*16): Top 0.035559375mm / dielectric 0.17018125mm / Route2 0.01778125mm / dielectric 47mil / Route15 0.01778125mm / dielectric 0.17018125mm / Bottom 0.035559375mm
Design rules "oshpark-4layer *": minimum track width 5mil, minimum drill 10mil, track to track 5mil, track to pad 5mil, pad to pad 5mil, via to via 5mil, smd to smd 5mil, copper to edge 15mil, drill to drill 6mil, minimum pad ring 4mil, minimum via ring 4mil, stop-mask expansion 2.5mil, vias tented up to drill 22mil, thermal gap 10mil

### Footprints (pad centres in the part's own frame; a part is rotated, then mirrored left to right if it is on the bottom)
C0402 = smd 0.6 x 0.7: 1 -0.5,0; 2 0.5,0
C0603 = smd 0.8 x 0.8: P$1 -0.75,0; P$2 0.75,0
1206 = smd 0.9 x 1.6: P$1 -1.55,0; P$2 1.55,0
CAP-E61 = smd 1.5 x 2.25: + 0,1.825; - 0,-1.825
SOIC8 = smd 0.55 x 1.5: 1 -1.905,-2.7; 2 -0.635,-2.7; 3 0.635,-2.7; 4 1.905,-2.7; 5 1.905,2.7; 6 0.635,2.7; 7 -0.635,2.7; 8 -1.905,2.7
TQFN16-EP = smd 0.3 x 0.8: 1 -0.75,-1.425; 2 -0.25,-1.425; 3 0.25,-1.425; 4 0.75,-1.425; 9 0.75,1.425; 10 0.25,1.425; 11 -0.25,1.425; 12 -0.75,1.425 | smd 0.8 x 0.3: 5 1.425,-0.75; 6 1.425,-0.25; 7 1.425,0.25; 8 1.425,0.75; 13 -1.425,0.75; 14 -1.425,0.25; 15 -1.425,-0.25; 16 -1.425,-0.75 | smd 1.23 x 1.23: EP 0,0
SOT23-5 = smd 0.6 x 1: 1 -0.95,-1.2; 2 0,-1.2; 3 0.95,-1.2; 4 0.95,1.2; 5 -0.95,1.2
TQFP32_7X7 = smd 1.5 x 0.5: 1 -4.4,2.8; 2 -4.4,2; 3 -4.4,1.2; 4 -4.4,0.4; 5 -4.4,-0.4; 6 -4.4,-1.2; 7 -4.4,-2; 8 -4.4,-2.8; 17 4.4,-2.8; 18 4.4,-2; 19 4.4,-1.2; 20 4.4,-0.4; 21 4.4,0.4; 22 4.4,1.2; 23 4.4,2; 24 4.4,2.8 | smd 0.5 x 1.5: 9 -2.8,-4.4; 10 -2,-4.4; 11 -1.2,-4.4; 12 -0.4,-4.4; 13 0.4,-4.4; 14 1.2,-4.4; 15 2,-4.4; 16 2.8,-4.4; 25 2.8,4.4; 26 2,4.4; 27 1.2,4.4; 28 0.4,4.4; 29 -0.4,4.4; 30 -1.2,4.4; 31 -2,4.4; 32 -2.8,4.4
TQFP-100-10X10 = smd 1.5 x 0.3: 1 -5.7,3.75; 2 -5.7,3.25; 3 -5.7,2.75; 4 -5.7,2.25; 5 -5.7,1.75; 6 -5.7,1.25; 7 -5.7,0.75; 8 -5.7,0.25; 9 -5.7,-0.25; 10 -5.7,-0.75; 11 -5.7,-1.25; 12 -5.7,-1.75; 13 -5.7,-2.25; 14 -5.7,-2.75; 15 -5.7,-3.25; 16 -5.7,-3.75; 33 5.7,-3.75; 34 5.7,-3.25; 35 5.7,-2.75; 36 5.7,-2.25; 37 5.7,-1.75; 38 5.7,-1.25; 39 5.7,-0.75; 40 5.7,-0.25; 41 5.7,0.25; 42 5.7,0.75; 43 5.7,1.25; 44 5.7,1.75; 45 5.7,2.25; 46 5.7,2.75; 47 5.7,3.25; 48 5.7,3.75 | smd 0.3 x 1.5: 17 -3.75,-5.7; 18 -3.25,-5.7; 19 -2.75,-5.7; 20 -2.25,-5.7; 21 -1.75,-5.7; 22 -1.25,-5.7; 23 -0.75,-5.7; 24 -0.25,-5.7; 25 0.25,-5.7; 26 0.75,-5.7; 27 1.25,-5.7; 28 1.75,-5.7; 29 2.25,-5.7; 30 2.75,-5.7; 31 3.25,-5.7; 32 3.75,-5.7; 49 3.75,5.7; 50 3.25,5.7; 51 2.75,5.7; 52 2.25,5.7; 53 1.75,5.7; 54 1.25,5.7; 55 0.75,5.7; 56 0.25,5.7; 57 -0.25,5.7; 58 -0.75,5.7; 59 -1.25,5.7; 60 -1.75,5.7; 61 -2.25,5.7; 62 -2.75,5.7; 63 -3.25,5.7; 64 -3.75,5.7
TSSOP16 = smd 0.35 x 1.4: 1 -2.275,-2.7; 2 -1.625,-2.7; 3 -0.975,-2.7; 4 -0.325,-2.7; 5 0.325,-2.7; 6 0.975,-2.7; 7 1.625,-2.7; 8 2.275,-2.7; 9 2.275,2.7; 10 1.625,2.7; 11 0.975,2.7; 12 0.325,2.7; 13 -0.325,2.7; 14 -0.975,2.7; 15 -1.625,2.7; 16 -2.275,2.7
SOIC-16 = smd 0.58 x 1.12: 1 -4.445,-2.64; 2 -3.175,-2.64; 3 -1.905,-2.64; 4 -0.635,-2.64; 5 0.635,-2.64; 6 1.905,-2.64; 7 3.175,-2.64; 8 4.445,-2.64; 9 4.445,2.64; 10 3.175,2.64; 11 1.905,2.64; 12 0.635,2.64; 13 -0.635,2.64; 14 -1.905,2.64; 15 -3.175,2.64; 16 -4.445,2.64
SOT-223 = smd 1.3 x 1.3: 1 -2.3,-3.05; 2 0,-3.05; 3 2.3,-3.05 | smd 3.6 x 1.3: 4 0,3.05
DPAK = smd 1.6 x 3: 1 -2.285,0; 3 2.285,0 | smd 5.8 x 6.2: 4 0,7.18
SMA-CINCH-142-0761-881-13.4 = smd 0.34 x 5.537: CENTER 0,-2.794 | smd 3.724 x 5.537: GND@1 -2.184,-2.769; GND@2 2.184,-2.769 | smd 8.128 x 5.537 bottom: GND@3 0,-2.769 | drill 1.143 pad 1.422 square: HOLE@1 -1.219,-3.962; HOLE@2 1.219,-3.962; HOLE@3 1.219,-1.753; HOLE@4 -1.219,-1.753 | drill 0.406 pad 0.61: VIA@1 -0.838,-5.194; VIA@2 0.838,-5.194; VIA@3 0.838,-2.857; VIA@4 0.838,-0.521; VIA@5 -0.838,-0.521; VIA@6 -0.838,-2.857
SMA_EDGE_LAUNCH_4L_4020_TAPER_FIXED = smd 4.572 x 9.144 bottom: BOTTOM_GND 2.286,0 | smd 3.81 x 1.016: CENTER@1 1.905,0 | drill 0.3: GND@1 1.143,3.937; GND@2 3.683,3.937; GND@3 1.143,1.651; GND@4 3.683,1.651; GND@5 1.143,-1.651; GND@6 3.683,-1.651; GND@7 1.143,-3.937; GND@8 3.683,-3.937; GND@14 2.413,3.937; GND@15 2.413,-3.937; GND@16 2.413,-1.651; GND@17 2.413,1.651 | smd 4.572 x 2.54: GND_PAD1 2.286,3.302; GND_PAD2 2.286,-3.302 | smd 0.127 x 0.127: P$1 4.191,1.143; P$2 4.191,-1.143; P$3 4.191,0
HEADER_6PIN = drill 1 pad 1.778 octagon: 1 -6.35,0; 2 -3.81,0; 3 -1.27,0; 4 1.27,0; 5 3.81,0; 6 6.35,0
FCI_20020316_SCREW_TERM_2P = drill 1.6 pad 3.81 long: P$1 -2.54,0; P$2 2.54,0
HEADER_10PIN = drill 1 pad 1.778 octagon: 1 -11.43,0; 2 -8.89,0; 3 -6.35,0; 4 -3.81,0; 5 -1.27,0; 6 1.27,0; 7 3.81,0; 8 6.35,0; 9 8.89,0; 10 11.43,0
ICSP_PAD = smd 1.905 x 1.905: P$1 0,0
R0603 = smd 0.95 x 0.95: P$1 -0.725,0; P$2 0.725,0
0402 = smd 0.6 x 0.7: 1 -0.5,0; 2 0.5,0
SMD_SWITCH = smd 1.6 x 1.4: P$1 -3.6,1.5; P$2 3.6,1.5; P$3 3.6,-1.5; P$4 -3.6,-1.5
HEADER_3PIN = drill 1 pad 1.93 octagon: 1 -2.54,0; 2 0,0; 3 2.54,0
LED_0603 = smd 0.8 x 0.8: A -0.75,0; C 0.75,0
XTAL_3.2X5 = smd 1.6 x 1.3: 1 -2,-1.25; 2 2,-1.25; 3 2,1.25; 4 -2,1.25

### Placement (x,y rotation side)
C1  11.81,73.91 180 top
C2  9.4,87.76 0 top
C3  15.11,96.14 90 top
C4  19.68,98.42 90 top
C5  16.51,58.55 270 top
C6  6.99,73.03 90 top
C7  43.18,15.24 270 top
C8  20.32,4.83 90 top
C9  20.32,10.16 270 top
C10  43.18,9.91 90 top
C11  17.14,86.87 90 top
C12  6.99,83.06 0 top
C13  31.11,29.34 90 top
C14  12.57,83.06 180 top
C15  53.34,93.34 180 top
C16  46.99,98.42 0 top
C17  49.53,86.36 180 top
C18  53.98,85.09 270 top
C19  50.8,8.26 0 top
C20  8.89,74.3 90 top
C22  10.92,80.64 270 top
C23  29.72,29.34 90 top
C26  8.26,17.78 0 top
C27  42.55,43.18 270 top
C28  43.18,63.12 180 top
C29  41.15,47.24 0 top
C30  28.19,72.01 90 top
C31  31.37,79.76 0 top
C35  8.89,80.64 270 top
C36  12.7,79.49 270 top
C37  12.7,75.44 90 top
C38  22.23,80.64 270 top
C39  24.26,69.34 270 top
C40  15.37,62.74 180 top
C41  16.51,43.18 180 top
C42  13.08,25.27 180 top
C43  15.75,25.27 0 top
C44  13.08,20.45 180 top
C45  15.75,20.45 0 top
C46  9.14,59.94 0 top
C47  13.72,59.94 180 top
C48  21.08,58.42 270 top
C49  18.54,53.72 180 top
C50  24.77,37.47 180 top
C51  26.04,87.63 180 top
C53  10.16,98.81 270 top
C54  12.7,86.74 90 top
IC1  17.78,77.47 270 top
IC2  10.16,77.47 270 top
IC3  31.37,77.22 270 top
IC4  27.3,92.71 0 top
IC5  19.05,92.71 0 top
IC6  10.79,92.71 0 top
IC7  11.43,53.34 90 top
IC8  11.43,40.64 270 top
IC9  11.43,66.04 180 top
IC10  19.68,66.04 270 top
IC11  24.77,58.42 0 top
IC12  43.18,55.24 270 top
IC13  14.48,29.08 90 top
IC14  14.48,16.51 270 top
IC15  37.34,29.21 0 top
IC16  23.11,40.51 180 top
IC17  13.97,6.35 90 top
IC18  36.83,11.43 90 top
IC19  48.9,93.34 90 top
IC20  48.9,81.28 90 top
J1  0,77.72 90 top
J2  0,15.24 0 top
J3  0,29.21 0 top
J4  55.88,46.35 90 top
J5  60.96,10.79 270 top
J6  61.59,93.98 270 top
J7  61.59,78.74 270 top
J8  53.98,69.22 90 top
P1  4.06,5.59 0 top
P2  31.11,21.59 0 top
P3  41.27,98.42 0 top
P4  41.27,86.36 0 top
R1  34.92,76.2 0 top
R2  17.02,81.92 270 top
R3  18.54,81.92 270 top
R4  15.49,81.92 90 top
R5  20.07,81.92 90 top
R6  12.32,70.87 180 top
R7  12.32,72.39 0 top
R8  34.16,34.42 90 top
R9  9.4,86.11 180 top
R10  15.24,92.71 90 top
R11  15.24,89.53 90 top
R12  6.99,90.17 270 top
R13  6.6,66.8 180 top
R14  20.32,51.18 180 top
R15  6.6,68.33 0 top
R16  6.6,63.75 0 top
R17  6.6,65.28 180 top
R18  18.8,71.12 90 top
R19  17.27,71.12 270 top
R20  20.32,71.12 90 top
R21  21.84,71.12 270 top
R22  8.13,45.21 180 top
R23  8.13,46.74 0 top
R24  14.73,45.21 0 top
R25  14.73,46.74 180 top
R26  21.08,29.97 0 top
R27  14.48,33.15 180 top
R28  21.08,26.67 0 top
R29  21.08,28.32 0 top
R30  7.75,31.37 180 top
R31  7.75,29.84 180 top
R32  7.75,28.32 180 top
R33  7.75,26.8 180 top
R34  25.15,66.67 180 top
R35  22.23,45.09 270 top
R36  20.32,40.01 90 top
R37  26.04,41.27 90 top
R38  20.32,45.09 270 top
R39  21.59,36.83 0 top
R40  18.41,36.83 0 top
R41  6.99,75.18 90 top
R42  53.34,41.27 270 top
R43  50.8,26.04 270 top
R44  45.72,26.04 270 top
R45  45.97,66.04 90 top
R46  39.24,34.42 90 top
R47  37.97,34.42 90 top
R48  36.7,34.42 90 top
R49  35.43,34.42 90 top
TP-2.048  26.67,98.93 0 top
TP-VREF  3.81,89.53 0 top
TP-VREF-DAC  17.14,99.06 0 top
U$18  30.86,72.01 0 top
U$67  8.26,15.24 270 top
U$84  56.52,32.38 180 top
U$95  48.26,22.23 180 top
U$97  46.74,68.71 0 top
U$160  34.29,64.77 180 top
X1  45.72,44.45 90 top

### Tracks (layer width: path | path; a pad name or v marks a point on that pad's centre or on a via)
!LE!
  Top 0.34: IC2.6 9.91,69.12 IC9.4
+5V  (via drill 0.3, 0.4, 0.55)
  Top 0.61: IC6.7 v10.16,96.9 C53.P$2 | v9.27,98.04 9.28,98.06 C53.P$2 | v11.05,98.04 10.17,98.04 C53.P$2 | v8.64,83.44 8.12,83.44 C12.P$2 7.99,82.8 v8.64,82.8 | v47.75,100.58 43.43,100.58 P3.P$1
  Top 1.016: C16.P$2 48.54,95.98 IC19.3
  other vias: 8.76,78.87 8.13,80.14 8.76,75.82 8.13,74.8 49.78,97.03 49.78,98.17 49.78,99.31 49.78,100.58 48.77,100.58
  pour Top (no thermals): 7.62,80.64 9.53,80.64 9.53,78.61 8.76,78.61 7.62,79.76
  pour Top (no thermals): 7.87,74.3 9.53,74.3 9.53,76.45 9.27,76.45 7.87,75.06
  pour Bottom (no thermals): 50.8,94.61 50.8,101.6 6.35,101.6 6.35,74.04 9.78,74.04 9.78,95.89 45.72,95.89 46.99,94.61
  pour Top (no thermals): 46.99,94.61 50.8,94.61 50.8,101.6 46.99,101.6
-5V  (via drill 0.3, 0.4, 0.5)
  Top 0.61: IC6.4 v12.7,88.65 C54.P$2 | C54.P$2 12.69,87.5 v11.81,87.5 | C54.P$2 12.71,87.5 v13.59,87.5 | v10.92,83.44 11.44,83.44 C14.P$2 11.57,82.8 v10.92,82.8
  other vias: 11.43,79.38 11.68,80.14 46.74,87.12 46.74,86.23 46.74,85.34 49.66,84.96 47.88,84.96 45.47,87.12 45.47,86.23 45.47,85.34 44.2,87.12 44.2,86.23 44.2,85.34
  pour Top (no thermals): 10.29,80.64 11.94,80.64 11.94,79.5 11.05,78.61 10.79,78.61 10.79,79.38 10.29,79.88
  pour Bottom (no thermals): 48.9,88.9 38.73,88.9 36.2,91.44 12.06,91.44 10.16,89.53 10.16,74.04 14.61,74.04 14.61,85.72 15.88,87 22.86,87 24.77,85.09 45.09,85.09 46.35,83.82 46.35,82.55 50.8,82.55 50.8,85.09 48.9,87
  pour Top (no thermals): 50.8,82.55 50.8,85.09 48.9,87 48.9,88.9 39.37,88.9 39.37,84.84 45.34,84.84 46.35,83.82 46.35,82.55
CLK-SEL0  (via drill 0.4)
  Top 0.254: IC12.27 34.31,53.99 32.89,52.58 32.89,36.07 v29.84,33.02 | IC13.16 10.68,26.81 v9.91,26.04
  Bottom 0.254: v9.91,26.04 13.08,29.21 17.14,29.21 20.95,33.02 v29.84,33.02
CLK-SEL1  (via drill 0.4)
  Top 0.254: IC12.40 42.93,50.54 42.67,50.8 42.67,51.44 v42.93,51.69 | v25.78,18.8 IC14.16
  Bottom 0.254: v42.93,51.69 42.67,51.44 42.67,50.42 42.16,49.91 35.31,49.91 34.29,48.9 34.29,27.3 v25.78,18.8
CLOCK-OUT  (1 unrouted)
  Top 0.34: J3.CENTER@1 6.99,29.21 7.02,29.25 R31.P$2 | R31.P$2 R30.P$2 | R31.P$2 R32.P$2 R33.P$2
COMP-OUT
  Top 0.254: IC12.12 41.43,61.95
  Top 0.34: 41.43,61.95 41.43,63.89 40.47,64.85 40.47,71.38 R1.P$2
COMP-REG-CLK  (via drill 0.4)
  Top 0.34: U$18.2 30.86,69.67 30.54,69.34 v30.48,69.34 | v29.84,59.44 29.84,39.37 21.81,31.33 R26.P$2
  Bottom 0.34: v30.48,69.34 29.84,68.71 v29.84,59.44
COUNTER-RESET  (via drill 0.35)
  Top 0.305: IC12.35 40.43,50.63 v40.01,51.05
  Top 0.34: IC15.1 32.89,27.81 v33.02,27.94
  Bottom 0.305: v40.01,51.05 35.56,51.05 33.66,49.15 33.66,28.57 v33.02,27.94
DELAY0  (via drill 0.35)
  Top 0.254: IC7.23 9.43,56.1 v9.53,56.01 | IC12.58 51.57,55.99 v51.63,55.94
  Bottom 0.254: v9.53,56.01 10.29,55.24 21.59,55.24 22.35,54.48 32.89,54.48 34.29,55.88 51.56,55.88 v51.63,55.94
DELAY1  (via drill 0.35)
  Top 0.254: IC7.25 5.46,56.14 v5.08,56.52 | IC12.55 50.18,54.49 v50.8,55.12
  Bottom 0.254: v5.08,56.52 5.71,55.88 8.89,55.88 10.03,54.74 21.34,54.74 22.1,53.98 33.15,53.98 34.59,55.42 49.1,55.42 49.4,55.12 v50.8,55.12
DELAY2  (via drill 0.35)
  Top 0.254: IC7.26 8.16,55.34 v8.26,55.24 | v51.69,54.36 51.31,53.98 48.9,53.98 IC12.54
  Bottom 0.254: v8.26,55.24 8.89,55.24 10.03,54.1 12.95,54.1 14.35,52.7 32.64,52.7 34.92,54.99 48.77,54.99 49.4,54.36 v51.69,54.36
DELAY3  (via drill 0.35)
  Top 0.254: IC7.27 8.71,54.54 v8.76,54.48 | IC12.53 48.91,53.47 50.67,53.47 v50.8,53.34
  Bottom 0.254: v8.76,54.48 9.65,53.59 12.57,53.59 13.97,52.2 32.89,52.2 35.18,54.48 48.51,54.48 49.66,53.34 v50.8,53.34
DELAY4  (via drill 0.35)
  Top 0.254: IC7.29 8.87,52.94 v8.89,52.96 | IC12.52 50.28,52.99 50.57,52.7 v51.69,52.7
  Bottom 0.254: v8.89,52.96 12.45,52.96 13.97,51.44 17.78,51.44 19.05,50.16 22.35,50.16 23.88,51.69 33.15,51.69 35.43,53.98 48.26,53.98 49.53,52.7 v51.69,52.7
DELAY5  (via drill 0.35)
  Top 0.254: IC7.30 8.19,52.14 v8.26,52.07 | IC12.51 48.92,52.45 50.04,52.45 50.42,52.07 v50.8,52.07
  Bottom 0.254: v8.26,52.07 11.94,52.07 14.1,49.91 18.54,49.91 18.8,49.66 22.61,49.66 24.13,51.18 33.4,51.18 35.69,53.47 48.01,53.47 49.4,52.07 v50.8,52.07
DELAY6  (via drill 0.35)
  Top 0.254: IC7.31 7.12,51.44 v8.89,51.44 | IC12.50 49.9,51.99 50.58,51.31 v51.69,51.31
  Bottom 0.254: v8.89,51.44 11.94,51.44 13.97,49.4 18.29,49.4 18.54,49.15 22.86,49.15 24.38,50.67 33.66,50.67 35.94,52.96 43.94,52.96 45.59,51.31 v51.69,51.31
DELAY7  (via drill 0.35)
  Top 0.254: IC7.32 8.25,50.54 v8.38,50.67 | IC12.49 48.88,51.37 49.45,50.8 50.8,50.8 v50.93,50.67
  Bottom 0.254: v8.38,50.67 12.06,50.67 13.84,48.9 18.03,48.9 18.29,48.64 23.11,48.64 24.64,50.16 33.78,50.16 36.07,52.45 43.56,52.45 45.34,50.67 v50.93,50.67
DELAY8  (via drill 0.35)
  Top 0.254: IC7.1 7.95,48.26 v6.99,48.26 | v28.96,48.9 28.96,49.29 28.98,49.31 28.98,59.59 29.46,60.07 35.05,60.07 36.63,58.49 IC12.18
  Bottom 0.254: v6.99,48.26 7.62,48.9 12.54,48.9 13.56,47.88 17.27,47.88 17.53,47.62 23.62,47.62 24.89,48.9 v28.96,48.9
DELAY9  (via drill 0.35)
  Top 0.254: IC7.2 9.43,49.88 9.17,50.14 8.23,50.14 v7.62,49.53 | v28.45,49.53 28.45,59.82 29.21,60.58 35.94,60.58 37.48,59.04 IC12.17
  Bottom 0.254: v7.62,49.53 8.13,50.04 12.06,50.04 13.72,48.39 17.65,48.39 17.91,48.13 23.37,48.13 24.77,49.53 v28.45,49.53
DELAY-!IN!
  Top 0.34: IC8.3 10.16,40.01 arc90 11.83,41.67 11.83,48.26 | IC7.5 11.83,48.26 | R25.P$2 13.35,46.74 11.83,48.26
  Top 0.61: R24.P$1 R25.P$2
DELAY-CLK
  Top 0.34: IC8.7 13.34,41.27 arc90 12.06,40.01 12.06,34.84 arc90 R27.P$2
DELAY-IN
  Top 0.34: 11.03,48.26 11.03,42.15 arc-90 10.16,41.27 IC8.2 | IC7.4 11.03,48.26 | 11.03,48.26 9.51,46.74 R23.P$2
  Top 0.61: R22.P$1 R23.P$2
FTUNE
  Top 0.34: IC7.17 14.29,57.8 C5.P$2 17.16,57.8 20.48,61.12 IC11.8
FTUNE-!CS!  (via drill 0.35)
  Top 0.254: IC12.44 44.93,58.19 44.83,58.29 v44.83,58.42 | v24.13,57.15 IC11.2
  Bottom 0.254: v44.83,58.42 43.81,57.4 28.07,57.4 27.18,58.29 25.27,58.29 v24.13,57.15
FTUNE-!LDAC!
  Top 0.254: IC11.5 27.14,61.59 38.78,61.59 IC12.16
FTUNE-SCK  (via drill 0.35)
  Top 0.254: IC12.47 46.43,56.59 v46.99,57.15 | v25.4,57.15 IC11.3
  Bottom 0.254: v46.99,57.15 46.74,56.9 27.81,56.9 26.92,57.78 26.04,57.78 v25.4,57.15
FTUNE-SDI  (via drill 0.35)
  Top 0.254: IC12.48 46.93,55.82 v47.62,56.52 | v26.67,57.15 IC11.4
  Bottom 0.254: v47.62,56.52 47.5,56.39 27.43,56.39 v26.67,57.15
GND  (via drill 0.3, 0.4, 0.55)  (4 unrouted)
  other vias: 9.91,79.76 6.6,78.36 6.6,77.09 7.87,78.36 7.87,77.09 9.78,77.85 10.54,77.85 10.54,77.09 9.78,77.09 19.18,75.56 21.72,75.56 19.94,74.8 20.95,74.8 19.81,83.69 20.57,83.69 21.08,82.68 15.75,83.69 14.99,83.69 14.48,82.68 21.84,82.3 22.61,82.3 23.24,81.28 17.78,79.76 17.02,77.85 8.13,81.03 8.13,81.66 9.91,80.9 11.68,81.79 11.68,81.15 12.45,80.9 13.21,80.9 13.59,80.01 13.46,75.06 13.08,74.17 13.08,73.53 11.94,74.68 13.97,72.9 13.97,72.01 9.14,73.03 8.51,73.03 7.24,71.75 6.6,71.75 17.4,72.9 16.64,72.9 21.72,72.9 22.48,72.9 23.88,70.99 24.64,70.99 25.27,70.1 21.08,64.14 23.62,64.14 21.84,63.37 22.86,63.37 4.83,68.2 4.83,68.96 4.83,63.88 4.83,63.12 17.02,63.12 17.02,62.36 16.13,61.85 6.35,46.48 6.35,47.24 16.51,47.24 16.51,46.48 18.16,43.69 18.16,42.8 15.37,38.73 13.59,37.97 14.61,37.97 13.59,26.16 15.37,26.16 15.37,24.38 13.59,24.38 14.48,26.16 14.48,24.38 5.33,29.84 5.33,28.57 5.33,15.88 5.33,14.61 7.49,18.8 6.6,18.16 6.6,17.4 8,14.22 6.99,13.46 6.1,13.97 14.35,21.46 14.35,19.43 13.59,19.43 13.46,21.46 15.24,21.46 15.11,19.43 8.64,59.05 8.64,56.52 8.38,53.72 5.71,53.72 14.48,50.55 17.14,50.55 22.1,51.44 22.1,50.8 7.87,59.05 15.37,60.33 15.37,59.56 16.89,60.33 16.13,60.33 24.13,62.48 24.13,59.82 20.19,54.1 20.19,53.34 24.89,62.48 20.7,60.2 21.46,60.2 22.23,59.18 43.69,64.14 44.45,64.14 39.88,46.35 40.64,46.35 43.43,50.93 43.05,62.23 43.18,59.69 45.85,46.86 45.85,45.97 46.99,45.09 48.13,46.48 47.5,67.82 47.5,69.6 29.21,76.2 29.72,75.44 30.48,75.44 32.64,71.12 32.64,70.36 31.88,69.85 27.81,70.36 28.57,70.36 29.72,80.14 29.72,79.38 41.78,25.53 41.78,27.69 42.55,27.05 42.55,26.16 29.21,27.69 29.97,27.69 30.73,27.69 31.5,27.69 39.24,27.69 37.97,27.69 36.7,27.69 35.43,27.69 35.43,25.53 36.7,25.53 37.97,25.53 39.24,25.53 23.11,42.67 23.11,43.43 16.64,37.21 16.64,36.58 26.42,37.85 26.42,37.21 9.78,100.46 10.54,100.46 12.32,85.09 13.08,85.09 19.18,100.08 20.07,100.08 18.41,96.65 27.94,94.11 14.73,97.79 15.49,97.79 18.41,94.11 27.94,96.65 29.21,96.65 29.21,94.11 29.21,91.31 29.21,88.77 26.67,91.31 26.67,88.77 27.69,88.01 27.69,87.25 14.86,87.76 15.62,87.76 16.76,85.22 17.53,85.22 20.32,10.79 19.56,10.79 21.08,10.79 20.32,12.83 19.56,12.83 21.08,12.83 20.32,4.19 19.56,4.19 21.08,4.19 20.32,2.29 21.08,2.29 19.56,2.29 16.64,2.54 17.53,2.54 18.41,2.54 18.41,3.43 18.41,4.32 43.18,9.27 42.42,9.27 43.94,9.27 43.18,7.37 42.42,7.37 43.94,7.37 43.18,15.88 42.42,15.88 43.94,15.88 43.94,17.78 43.18,17.78 42.42,17.78 39.24,7.62 40.26,7.62 41.27,9.53 41.27,8.64 41.27,7.62 47.62,77.47 39.37,95.89 39.37,90.81 39.37,94.23 39.37,92.46 48.9,77.47 50.16,77.47 57.15,78.11 57.15,74.3 65.79,78.11 65.79,74.3 57.15,93.22 57.15,89.79 65.79,89.66 65.79,93.34 53.21,87.88 54.74,87.88 53.21,85.47 54.74,85.47 51.05,87.88 51.56,84.84 50.04,87.88 50.04,86.87 53.72,94.11 53.72,92.71 56.13,94.11 56.13,92.71 44.2,99.19 44.2,97.66 46.61,99.06 46.61,97.79 5.33,83.44 5.33,82.68 14.22,83.44 13.21,82.04 13.84,82.04 9.91,81.53 38.61,36.45 38.61,38.99 37.34,38.99 36.07,38.99 34.8,38.99 36.07,36.45 37.34,36.45 34.8,36.45 34.8,41.53 36.07,41.53 37.34,41.53 38.61,41.53 38.61,44.7 36.07,44.07 34.8,44.07 35.81,46.99 39.88,44.7 39.88,38.99 39.88,36.45 39.88,40.89 32.38,44.07 32.38,41.53 32.38,38.99 32.38,36.45 32.38,46.61 32.38,49.15 32.38,55.5 30.48,55.5 49.53,4.45 50.8,4.45 52.07,4.45 52.7,5.71 48.9,5.71 48.9,6.99 52.7,6.99
  pour Top (rank 2, no thermals): 0,0 66.67,0 66.67,101.6 0,101.6
  pour Route2 (rank 2, no thermals): 0,0 66.67,0 66.67,101.6 0,101.6
  pour Bottom (rank 2, no thermals): 0,0 66.67,0 66.67,101.6 0,101.6
  pour Bottom (rank 2, no thermals): 0,0 66.67,0 66.67,101.6 0,101.6
  cutout Top (no thermals): 9.53,75.56 9.53,70.48 8.89,69.85 8.89,67.31 11.43,67.31 11.43,69.85 10.79,70.48 10.79,75.56
  cutout Top (no thermals): 6.99,67.31 9.53,67.31 arc-90 12.7,64.14 12.7,62.23 12.32,61.85 12.32,56.64 10.54,56.64 10.54,61.85 10.16,62.23 10.16,63.5 arc90 8.89,64.77 6.99,64.77
  cutout Top (no thermals): 12.06,69.85 13.97,69.85 13.97,69.22 arc90 15.24,67.94 17.14,67.94 arc90 17.78,68.58 17.78,71.12 20.95,71.12 20.95,67.31 arc-90 18.41,64.77 14.61,64.77 arc-90 11.43,67.94 11.43,69.85
  cutout Top (no thermals): 9.78,50.16 13.08,50.16 13.08,49.15 14.61,47.62 14.61,44.32 13.84,44.32 13.34,43.81 13.34,41.91 arc-90 10.16,38.73 7.62,38.73 7.62,41.91 9.53,41.91 arc90 10.16,42.55 10.16,43.81 9.78,44.2 8.26,44.2 8.26,47.62 9.78,49.15
  cutout Top (no thermals): 11.43,78.11 13.34,78.11 13.97,78.74 15.88,78.74 arc90 16.51,79.38 16.51,80.64 16.51,81.92 19.05,81.92 19.05,79.38 arc-90 15.88,76.2 13.97,76.2 13.34,76.83 11.43,76.83
INPUT
  Top 0.305: IC2.2 8,77.72
  Top 0.34: 8,77.72 J1.CENTER
INT-CLK  (via drill 0.4)
  Top 0.305: IC12.21 36.35,56.99 36.2,57.15
  Top 0.34: 36.2,57.15 33.15,57.15 30.73,54.74 30.73,38.35 v23.5,31.11 | IC14.9 22.49,14.23 v23.5,15.24
  Bottom 0.34: v23.5,15.24 v23.5,31.11
LE
  Top 0.34: IC2.7 10.41,69.12 IC9.3
N$2
  pour Top (no thermals): 10.79,76.45 10.79,70.23 11.81,70.23 11.81,75.56 10.92,76.45
N$4
  Top 0.305: IC2.10 12.06,77.22
  Top 0.34: 12.06,77.22 13.81,77.22 14.19,76.83 IC1.3 16,76.83 arc90 18.54,79.38 R3.P$2
  Top 0.61: R5.P$1 R3.P$2
N$5
  Top 0.305: IC2.11 12.06,77.72
  Top 0.34: 12.06,77.72 13.81,77.72 14.19,78.11 IC1.2 15.75,78.11 arc90 17.02,79.38 R2.P$2
  Top 0.61: R4.P$1 R2.P$2
N$6  (via drill 0.5)
  Top 0.61: R11.P$2 R10.P$1 13.63,91.98 13.59,91.95 v13.53,92.01 | R9.P$1 10.15,86.13 C2.P$2 IC6.2 v10.16,91.44
  Bottom 0.61: v13.53,92.01 10.73,92.01 v10.16,91.44
N$7
  Top 0.34: IC1.7 20.54,78.17 IC3.1
N$8
  Top 0.34: IC3.4 34.13,76.27 R1.P$1
N$9
  Top 0.34: U$18.4 31.37,73.65 31.37,76.71 30.86,77.22 IC3.2
N$10  (via drill 0.35)
  Top 0.254: IC12.7 43.93,59.96 44.45,59.44 v47.37,59.44
  Bottom 0.254: v47.37,59.44 49.15,59.44 53.98,54.61 57.15,54.61 58.42,53.34 58.42,42.55 J4.1
  pour Top (no thermals): 51.44,36.2 51.44,32.38 62.23,32.38 62.23,36.2 57.15,41.27 52.07,41.27 51.44,40.64
N$11
  Top 0.61: IC6.6 11.43,93.98 10.16,92.71 8.26,92.71 6.99,91.44 R12.P$1
N$12
  Top 0.61: IC6.3 11.43,91.44 15.11,95.12 C3.P$1 17.12,95.39 IC5.8 TP-VREF-DAC.P$1
N$13
  Top 0.61: IC15.12 R47.1
N$18
  Top 0.34: IC7.10 19.44,51.34 R14.P$2
N$23
  Top 0.34: IC13.5 18.87,29.41 19.43,29.97 R26.P$1
N$24
  Top 0.34: IC10.7 R34.P$2
N$25
  Top 0.34: IC7.20 11.83,61.99 12.06,62.23 IC9.7 12.06,64.14 arc90 9.53,66.67 7.46,66.67 arc-90 R13.P$1
  Top 0.61: R15.P$2 R13.P$1
N$26
  Top 0.34: R18.P$1 18.8,67.94 arc-90 17.53,66.67 IC10.2 15.11,66.67 arc-90 13.34,68.45 IC9.1
  Top 0.61: R19.P$2 R18.P$1
N$27
  Top 0.34: IC7.21 11.03,61.99 10.79,62.23 IC9.6 10.79,64.14 arc90 9.53,65.41 7.46,65.41 arc90 R17.P$1
  Top 0.61: R17.P$1 R16.P$2
N$29
  Top 0.34: IC13.6 16.3,30.06 arc-90 15.24,31.11 15.24,33.11 arc90 R27.P$1
N$30
  Top 0.34: IC13.4 18.87,28.76 19.3,28.32 R29.P$1
N$31
  Top 0.34: IC14.8 9.51,14.23 U$67.4
N$32  (via drill 0.35)
  Top 0.34: IC13.8 16.01,31.36 arc-90 v16,31.37 | v10.16,19.68 10.54,19.3 10.54,17.91 10.96,17.48 IC14.3
  Bottom 0.34: v16,31.37 10.79,31.37 arc90 8.89,29.46 8.89,20.95 v10.16,19.68
N$33
  Top 0.34: IC13.3 18.25,28.11 19.68,26.67 R28.P$1
N$34
  Top 0.34: R28.P$2 24.26,26.67 25.65,25.27 33.53,25.27 34.16,25.91 IC15.2
N$35
  Top 0.406: IC16.3 22.23,41.77 R35.P$2 R38.P$2
N$36
  Top 0.34: IC13.11 10.84,30.06 9.53,31.37 R30.P$1
N$37
  Top 0.34: IC13.12 10.09,29.41 9.65,29.84 R31.P$1
N$38
  Top 0.34: IC13.13 10.09,28.76 9.65,28.32 R32.P$1
N$39
  Top 0.34: IC13.14 10.96,28.11 9.65,26.8 R33.P$1
N$40
  Top 0.34: IC9.2 12.06,68.33 arc90 14.99,65.41 IC10.3 17.78,65.41 arc90 20.32,67.94 R20.P$1
  Top 0.61: R20.P$1 R21.P$2
N$41
  Top 0.406: R37.P$1 22.23,40.55 | 22.23,40.55 20.5,40.55 R36.P$2 | IC16.4 22.16,40.49 22.23,40.55
N$42
  Top 0.279: IC2.3 IC2.4
  Top 0.305: IC2.4 7.7,75.68 R41.2
N$43  (via drill 0.35)
  Top 0.254: IC12.37 41.43,48.54 v41.27,48.39
  Bottom 0.254: v41.27,48.39 55.12,48.39 J4.4
  pour Bottom (no thermals): 56.26,46.74 54.74,46.74 53.02,48.45 53.09,48.51 56.26,48.51
N$44
  Top 0.61: R40.P$2 20.32,36.83 | 20.32,36.83 R39.P$1 | R36.P$1 20.32,36.83
N$45
  Top 0.254: IC12.42 43.93,48.53 44.2,48.26 53.98,48.26 J4.5
  pour Top (no thermals): 55.24,50.8 54.61,50.16 54.61,48.9 56.01,48.9 56.58,49.47
N$46
  Top 0.254: R45.P$2 45.97,68.69 U$97.A
N$47
  Top 0.305: IC12.39 42.43,48.38 44.35,46.45 X1.3
N$48  (via drill 0.35)
  Top 0.254: IC12.32 36.58,50.59 v36.58,48.51 | v45.72,28.57 R44.P$1
  Bottom 0.254: v36.58,48.51 36.58,45.21 45.72,36.07 v45.72,28.57
N$49  (via drill 0.35)
  Top 0.254: IC12.31 38.68,51.99 38.99,51.69 38.99,51.05 37.21,49.28 v37.21,49.15 | v50.8,28.57 R43.P$1
  Bottom 0.254: v37.21,49.15 37.21,45.34 50.8,31.75 v50.8,28.57
N$50
  Top 0.254: IC12.3 45.93,65.27 R45.P$1
N$51
  Top 1.016: IC17.3 20.28,8.65 C9.P$2 23.77,8.61 24.13,8.26 | IC18.3 43.14,13.73 C7.P$2 46,13.69 46.35,13.34
  Top 2.54: 46.35,13.34 50.8,13.34 | 50.8,13.34 J5.P$1 54.61,13.34 | 24.13,8.26 24.13,5.08 26.67,2.54 43.81,2.54 46.99,5.71 46.99,8.89 48.18,10.08 C19.+ 50.8,13.34
N$52
  Top 1.016: J6.P$1 53.98,96.52 51.79,94.33 C15.P$2 49.51,91.06 IC19.1
N$53
  Top 1.016: J7.P$1 58.29,81.28 56.01,83.57 54,83.57 C18.P$2 53.06,83.54 50.8,81.28 IC20.4
N$54  (via drill 0.4)
  Top 0.254: IC12.19 34.72,57.99 v34.29,58.42
  Bottom 0.254: v34.29,58.42 U$160.2
N$55
  Top 0.61: IC15.11 R46.1
N$56
  Top 0.61: IC15.15 R8.1
N$57
  Top 0.61: IC15.13 R48.1
N$58
  Top 0.61: IC15.14 R49.1
OSC-FB  (via drill 0.4)
  Top 0.34: R34.P$1 25.87,65.88 v25.4,65.41 | v11.43,32.38 11.78,32.04 IC13.9
  Bottom 0.34: v25.4,65.41 11.16,65.41 10.75,65 10.75,64.98 4.32,58.55 4.32,39.5 v11.43,32.38
Q0
  Top 0.305: 35.81,52.96 35.85,52.99 IC12.29
  Top 0.34: R49.2 35.43,46.48 35.05,46.86 35.05,52.2 35.81,52.96
Q1
  Top 0.305: IC12.30 36.24,52.49 36.2,52.45
  Top 0.34: R48.2 36.7,47.12 35.94,47.88 35.94,52.2 36.2,52.45
Q2
  Top 0.305: IC12.33 39.41,49.53 38.73,49.53
  Top 0.34: R47.2 37.97,42.55 37.97,46.35 | 37.97,46.35 37.97,48.77 38.73,49.53 | 37.97,46.35
Q3
  Top 0.305: IC12.34 39.93,48.44 39.75,48.26
  Top 0.34: R46.2 39.24,45.21 39.12,45.34 39.12,47.88 39.5,48.26 39.75,48.26
RE0
  Top 0.254: IC12.2 46.43,62.3 49.66,65.53 49.66,73.79 J8.9
  pour Top (no thermals): 53.34,78.74 52.7,78.11 52.7,76.83 53.98,76.83 54.61,77.47
RE1
  Top 0.254: IC12.1 50.16,64.18 50.16,71.75 J8.8
  pour Top (no thermals): 54.61,74.93 53.34,76.2 52.7,75.56 52.7,74.3 53.98,74.3
RE2
  Top 0.254: IC12.64 50.67,60.79 50.67,69.72 J8.7
  pour Top (no thermals): 53.34,73.66 52.7,73.03 52.7,71.75 53.98,71.75 54.61,72.39
RE3
  Top 0.254: IC12.63 49.73,58.49 51.18,59.94 51.18,67.69 J8.6
  pour Top (no thermals): 53.34,71.12 52.7,70.48 52.7,69.22 53.98,69.22 54.61,69.85
RE4
  Top 0.254: IC12.62 49.99,57.99 51.69,59.69 51.69,65.66 J8.5
  pour Top (no thermals): 53.34,68.58 52.7,67.94 52.7,66.67 53.98,66.67 54.61,67.31
RE5
  Top 0.254: IC12.61 50.26,57.49 52.2,59.44 52.2,63.63 J8.4
  pour Top (no thermals): 53.34,66.04 52.7,65.41 52.7,64.14 53.98,64.14 54.61,64.77
RE6
  Top 0.254: IC12.60 50.52,56.99 52.7,59.18 52.7,61.59 J8.3
  pour Top (no thermals): 53.34,63.5 52.7,62.87 52.7,61.59 53.98,61.59 54.61,62.23
RE7
  Top 0.254: IC12.59 48.9,56.52 52.07,56.52 52.7,55.88 55.24,55.88 55.88,56.52 55.88,58.42 J8.2
  pour Top (no thermals): 53.34,59.69 54.61,60.96 55.24,60.33 55.24,59.05 53.98,59.05
RX
  pour Top (no thermals): 44.45,20.95 44.45,25.4 45.09,26.04 46.35,26.04 46.99,25.4 46.99,20.95
SAMPLE-CLK
  Top 0.305: IC12.22 36.22,56.49 36.2,56.52
  Top 0.34: R29.P$2 23.24,28.32 31.75,36.83 31.75,53.98 34.29,56.52 36.2,56.52
TC
  Top 0.305: IC12.28 arc-90 37.45,53.47 36.07,53.47
  Top 0.34: R8.2 34.16,51.44 34.16,51.56 34.16,52.58 35.05,53.47 36.07,53.47
TEMP-ADC
  Top 0.254: IC12.11 41.93,60.09 41.4,59.56 39.37,59.56 37.85,61.09 28.96,61.09 27.69,59.82 27.69,43.65 R37.P$2
  Top 0.406: IC16.1 24.35,42 R37.P$2
TEMP-SENSE
  Top 0.34: IC7.14 16.82,54.54 17.53,55.24 20.95,55.24 23.5,52.7 23.5,47.08 R35.P$1
TRIGGER  (1 unrouted)
  Top 0.34: J2.CENTER@1 U$67.2
TX
  pour Top (no thermals): 49.53,20.95 49.53,25.4 50.16,26.04 51.44,26.04 52.07,25.4 52.07,20.95
V2.048
  Top 0.61: R10.P$2 15.33,93.34 19.68,93.34 IC5.6 C4.P$1 23.14,97.67 IC4.8 IC4.7 TP-2.048.P$1
VCC1  (via drill 0.3, 0.4, 0.55)
  Top 0.305: IC4.3 27.94,91.44 27.3,92.08 26.04,92.08 25.4,91.44 IC4.1
  Top 0.34: IC11.6 25.4,59.56 v22.86,57.02
  Top 0.508: v13.97,71.25 13.43,71.25 R6.P$1 13.43,70.48 v13.97,70.48 | C46.P$2 10.23,59.61 IC7.22 10.23,56.57 v10.29,56.52 | v10.29,60.96 10.29,60.34 C46.P$2 | v9.53,60.96 9.53,60.31 C46.P$2 | v10.16,58.93 10.16,59.68 C46.P$2 | C49.P$2 17.77,53.74 IC7.13 14.5,53.74 v14.48,53.72 | IC7.19 12.63,56.57 v12.57,56.52 | IC7.18 13.43,56.55 v13.46,56.52
  Top 0.61: v10.29,56.52 10.67,56.13 v11.05,56.13 v11.81,56.13 12.19,56.13 v12.57,56.52 | IC4.1 v25.4,88.77 25.4,87.75 C51.P$2 | v24.38,88.01 24.9,88.01 C51.P$2 | v24.38,87.25 24.9,87.25 C51.P$2 | P1.P$1 6.48,5.59 v6.99,5.08 v8.26,6.35 | IC5.1 v17.14,91.44 | IC5.1 17.14,89.03 v16.64,88.52 16.64,88.13 C11.P$2 17.53,88 v17.53,88.52 17.14,88.9 IC5.1
  other vias: 11.81,78.87 11.94,76.07 13.46,78.87 13.46,75.95 16.64,83.69 17.4,83.69 18.16,83.69 18.92,83.69 20.07,80.14 20.83,80.14 23.11,80.14 23.11,79.38 18.41,72.9 19.18,72.9 19.94,72.9 20.7,72.9 21.84,68.71 22.73,68.71 25.27,68.96 25.27,68.2 4.83,67.18 4.83,66.42 4.83,65.66 4.83,64.9 13.34,64.64 13.34,62.1 14.61,63.75 14.61,61.72 6.35,44.83 6.35,45.59 16.51,45.59 16.51,44.83 13.72,43.31 14.61,43.31 14.99,44.07 13.08,27.3 16,27.3 11.43,25.65 11.43,24.89 17.4,25.78 17.4,24.89 13.97,27.3 15.11,27.3 11.43,20.83 11.43,20.07 17.4,20.83 17.4,20.07 12.95,18.16 16,18.16 15.24,18.16 13.72,18.16 12.7,58.93 13.46,58.93 12.7,60.96 13.46,60.96 21.08,55.88 20.07,57.66 21.08,56.64 22.1,55.75 24.89,39.24 24,36.45 22.35,35.81 10.79,8.89 10.79,3.81 9.53,3.81 9.53,5.08 9.53,6.35 9.53,7.62 9.53,8.89 12.06,8.89 13.34,8.89 12.06,3.81 13.34,3.81 12.7,5.08 12.7,7.62 12.7,6.35 8.26,8.89 8.26,7.62 8.26,5.08 8.26,3.81 8.26,2.54 9.53,2.54 10.79,2.54 12.06,2.54 13.34,2.54 8.26,10.16 9.53,10.16 10.79,10.16 12.06,10.16 13.34,10.16 13.97,6.99 13.97,5.71 6.99,10.16 6.99,8.89 6.99,7.62 6.99,6.35 6.99,3.81 6.99,2.54 6.99,1.27 8.26,1.27 9.53,1.27 10.79,1.27 12.06,1.27 13.34,1.27
  pour Top (no thermals): 16.38,81.92 19.18,81.92 19.18,84.07 16.38,84.07
  pour Top (no thermals): 19.68,79.12 23.5,79.12 23.5,80.64 20.95,80.64 20.7,80.39 19.68,80.39
  pour Top (no thermals): 11.18,78.11 13.34,78.11 13.84,78.61 13.84,79.38 12.19,79.38 11.18,78.36
  pour Top (no thermals): 11.18,76.83 13.08,76.83 13.59,76.33 13.59,75.56 12.32,75.56 11.18,76.71
  pour Top (no thermals): 18.03,73.28 18.03,71.25 21.08,71.25 21.08,73.28
  pour Top (no thermals): 21.59,67.69 25.53,67.69 25.53,69.22 21.59,69.22
  pour Top (no thermals): 4.45,67.56 6.6,67.56 6.6,64.52 4.45,64.52
  pour Top (no thermals): 13.08,64.77 15.24,64.77 15.24,61.59 13.08,61.59
  pour Top (no thermals): 6.1,45.85 8.13,45.85 8.13,44.45 6.1,44.45
  pour Top (no thermals): 14.73,45.85 14.73,44.45 13.34,43.05 13.34,42.29 16.57,42.29 16.51,44.07 16.89,44.45 16.89,45.85
  pour Top (no thermals): 11.05,27.69 17.91,27.69 17.91,24.38 15.88,24.38 15.88,26.8 13.08,26.8 13.08,24.38 10.79,24.38 10.79,26.04 12.7,26.04 12.7,27.3 11.05,27.3
  pour Top (no thermals): 11.05,17.91 17.78,17.91 17.78,18.29 16.26,18.29 16.26,19.18 17.91,19.18 17.91,21.08 15.75,21.08 15.75,18.54 13.08,18.54 13.08,21.08 11.05,21.08
  pour Top (no thermals): 12.45,57.02 13.59,57.02 13.59,61.21 12.45,61.21
  pour Top (no thermals): 19.68,58.29 23.11,58.29 23.11,54.99 20.7,54.99 20.7,56.01 19.68,56.01
  pour Top (no thermals): 23.62,39.75 25.15,39.75 25.15,38.48 24.77,38.1 24.77,35.56 21.72,35.56 21.72,37.59 21.97,37.85 22.73,37.85 23.62,38.73
  pour Route15 (no thermals): 0,101.6 0,0 25.4,0 25.4,34.29 27.3,36.2 27.3,67.94 25.4,69.85 25.4,81.28 27.94,83.82 37.47,83.82 37.47,101.6
  pour Top (no thermals): 5.71,11.94 15.62,11.94 15.62,7.62 21.59,7.62 21.59,5.08 15.62,5.08 15.62,0 5.71,0
  pour Bottom (no thermals): 5.71,0 15.88,0 15.88,12.06 5.71,12.06
VCC2  (via drill 0.4, 0.55)
  Top 0.305: C28.P$2 IC12.10 42.43,59.7 | C29.P$2 41.93,47.38 IC12.38 41.93,50.91 v41.91,50.93
  Top 0.508: v42.04,64.14 42.04,63.51 C28.P$2 42.8,63.49 v42.8,64.14 | v41.53,46.35 41.53,46.98 41.93,47.38 42.29,47.02 v42.29,46.35
  Top 0.61: v41.91,51.56 41.93,51.54 41.93,50.91 | v42.42,59.05 v42.42,59.69 42.43,59.7 | v40.51,30.73 IC15.10 | v41.78,30.73 IC15.9 | v40.51,27.69 IC15.7 | P2.P$1 31.11,16.51 | 53.61,42.27 R42.P$1 51.91,42 v51.69,41.78 | 53.61,42.27 53.88,42.55 J4.2 | v51.69,42.8 52.22,42.27 53.61,42.27
  Top 1.27: v31.11,15.24 23.5,22.86 10.79,22.86 8.76,20.83 v8.76,18.8
  other vias: 8.51,16.26 9.53,18.8 9.53,15.37 9.91,17.78 44.07,43.81 44.96,43.81 41.53,42.42 42.55,41.53 44.07,41.15 44.96,41.15 33.02,80.14 33.02,79.38 27.81,73.66 28.57,73.66 29.84,72.26 29.84,74.17 33.53,78.23 31.62,78.23 30.86,30.99 32.89,32.89 32.89,30.73 31.62,30.99 30.1,30.99 29.34,30.99 32.38,10.16 32.38,11.43 32.38,12.7 32.38,13.97 33.66,13.97 32.38,8.89 33.66,8.89 34.92,8.89 34.92,13.97 35.56,12.7 35.56,11.43 35.56,10.16 36.2,13.97 36.2,8.89 31.11,13.97 31.11,12.7 31.11,11.43 31.11,10.16 31.11,8.89 31.11,7.62 32.38,7.62 33.66,7.62 34.92,7.62 36.2,7.62 32.38,15.24 33.66,15.24 34.92,15.24 36.2,15.24 36.83,12.06 36.83,10.79
  pour Top (no thermals): 8.26,19.05 8.26,15.24 10.16,15.24 10.16,19.05
  pour Top (no thermals): 41.27,43.05 43.05,43.05 44.07,44.07 45.21,44.07 45.21,40.89 41.27,40.89
  pour Top (no thermals): 27.56,72.01 30.35,72.01 30.35,74.42 27.56,74.42
  pour Top (no thermals): 31.37,80.39 31.37,77.85 33.78,77.85 33.78,80.39
  pour Top (no thermals): 28.96,29.34 33.15,29.34 33.15,33.02 32.38,33.02 30.99,31.62 28.96,31.62
  pour Route15 (no thermals): 39.37,101.6 39.37,82.55 38.73,81.92 28.57,81.92 27.3,80.64 27.3,69.85 29.84,67.31 29.84,36.2 27.3,33.66 27.3,0 66.67,0 66.67,101.6
  pour Top (no thermals): 44.45,12.57 44.45,10.41 38.48,10.41 38.48,4.32 27.3,4.32 27.3,18.29 38.48,18.29 38.48,12.57
  pour Bottom (no thermals): 27.3,4.45 38.73,4.45 38.73,18.41 27.3,18.41
VREF  (via drill 0.4)
  Top 0.305: R9.P$2 7.02,84.45 v6.99,84.45 | v6.1,74.68 R41.1
  Top 0.61: R41.1 C6.2 | C2.P$1 8.67,87.73 | 8.67,87.73 R9.P$2 | 8.67,87.73 8.67,87.76 R12.P$2 6.89,89.53 TP-VREF.P$1
  Bottom 0.305: v6.99,84.45 5.97,83.44 5.97,74.8 v6.1,74.68
VREF-!CS!  (via drill 0.35)
  Top 0.254: IC12.43 44.43,57.55 43.81,58.17 v43.81,58.55 | IC5.2 18.41,88.27 v23.75,82.93
  Bottom 0.254: v23.75,82.93 24.51,82.17 33.53,82.17 40.51,75.18 40.51,69.34 45.09,64.77 45.09,62.23 43.81,60.96 v43.81,58.55
VREF-!LDAC!  (via drill 0.35)
  Top 0.254: 39.93,62.2 IC12.15 | IC5.5 22.23,94.14 22.23,87.38 25.4,84.2 v25.4,81.64
  Top 0.305: v39.9,62.23 39.93,62.2
  Bottom 0.254: v39.9,62.23 39.9,75.04 33.3,81.64 v25.4,81.64
VREF-SCK  (via drill 0.35)
  Top 0.254: IC12.45 45.43,58 v45.72,58.29 | IC5.3 19.68,88.01 v23.75,83.95
  Bottom 0.254: v23.75,83.95 25.02,82.68 33.78,82.68 41.02,75.44 41.02,69.6 45.97,64.64 45.97,58.55 v45.72,58.29
VREF-SDI  (via drill 0.35)
  Top 0.254: IC12.46 45.93,57.36 v46.35,57.78 | IC5.4 20.95,87.63 v24.77,83.82
  Bottom 0.254: v46.35,57.78 46.53,57.96 46.53,64.85 41.53,69.85 41.53,75.69 34.04,83.19 25.4,83.19 v24.77,83.82

### Text on the board
tPlace: DAC | 2.048 | +5 | +7.5 | VREF | GND | -5 | -7.5 | GND | E0 | RE1 | RE2 | INPUT | RE3 | GND | +3.3 | RE4 | RE5 | ADCMP582 Sampler | Yapo 9/2019 | RE6 | GND | RG7 | RE7 | GND | 6 | Proto 2 | ICSP | 1 | CLOCK OUT | RESET | GND | +3.3 (CMOS) | TRIGGER IN | RX | TX | +4.5 | GND | +3.3 (ECL)
bPlace: 8 GHz or bust!